# EAGLE schematic edcmain (EAGLE 9.6.2)

## Sheet 1 of 7
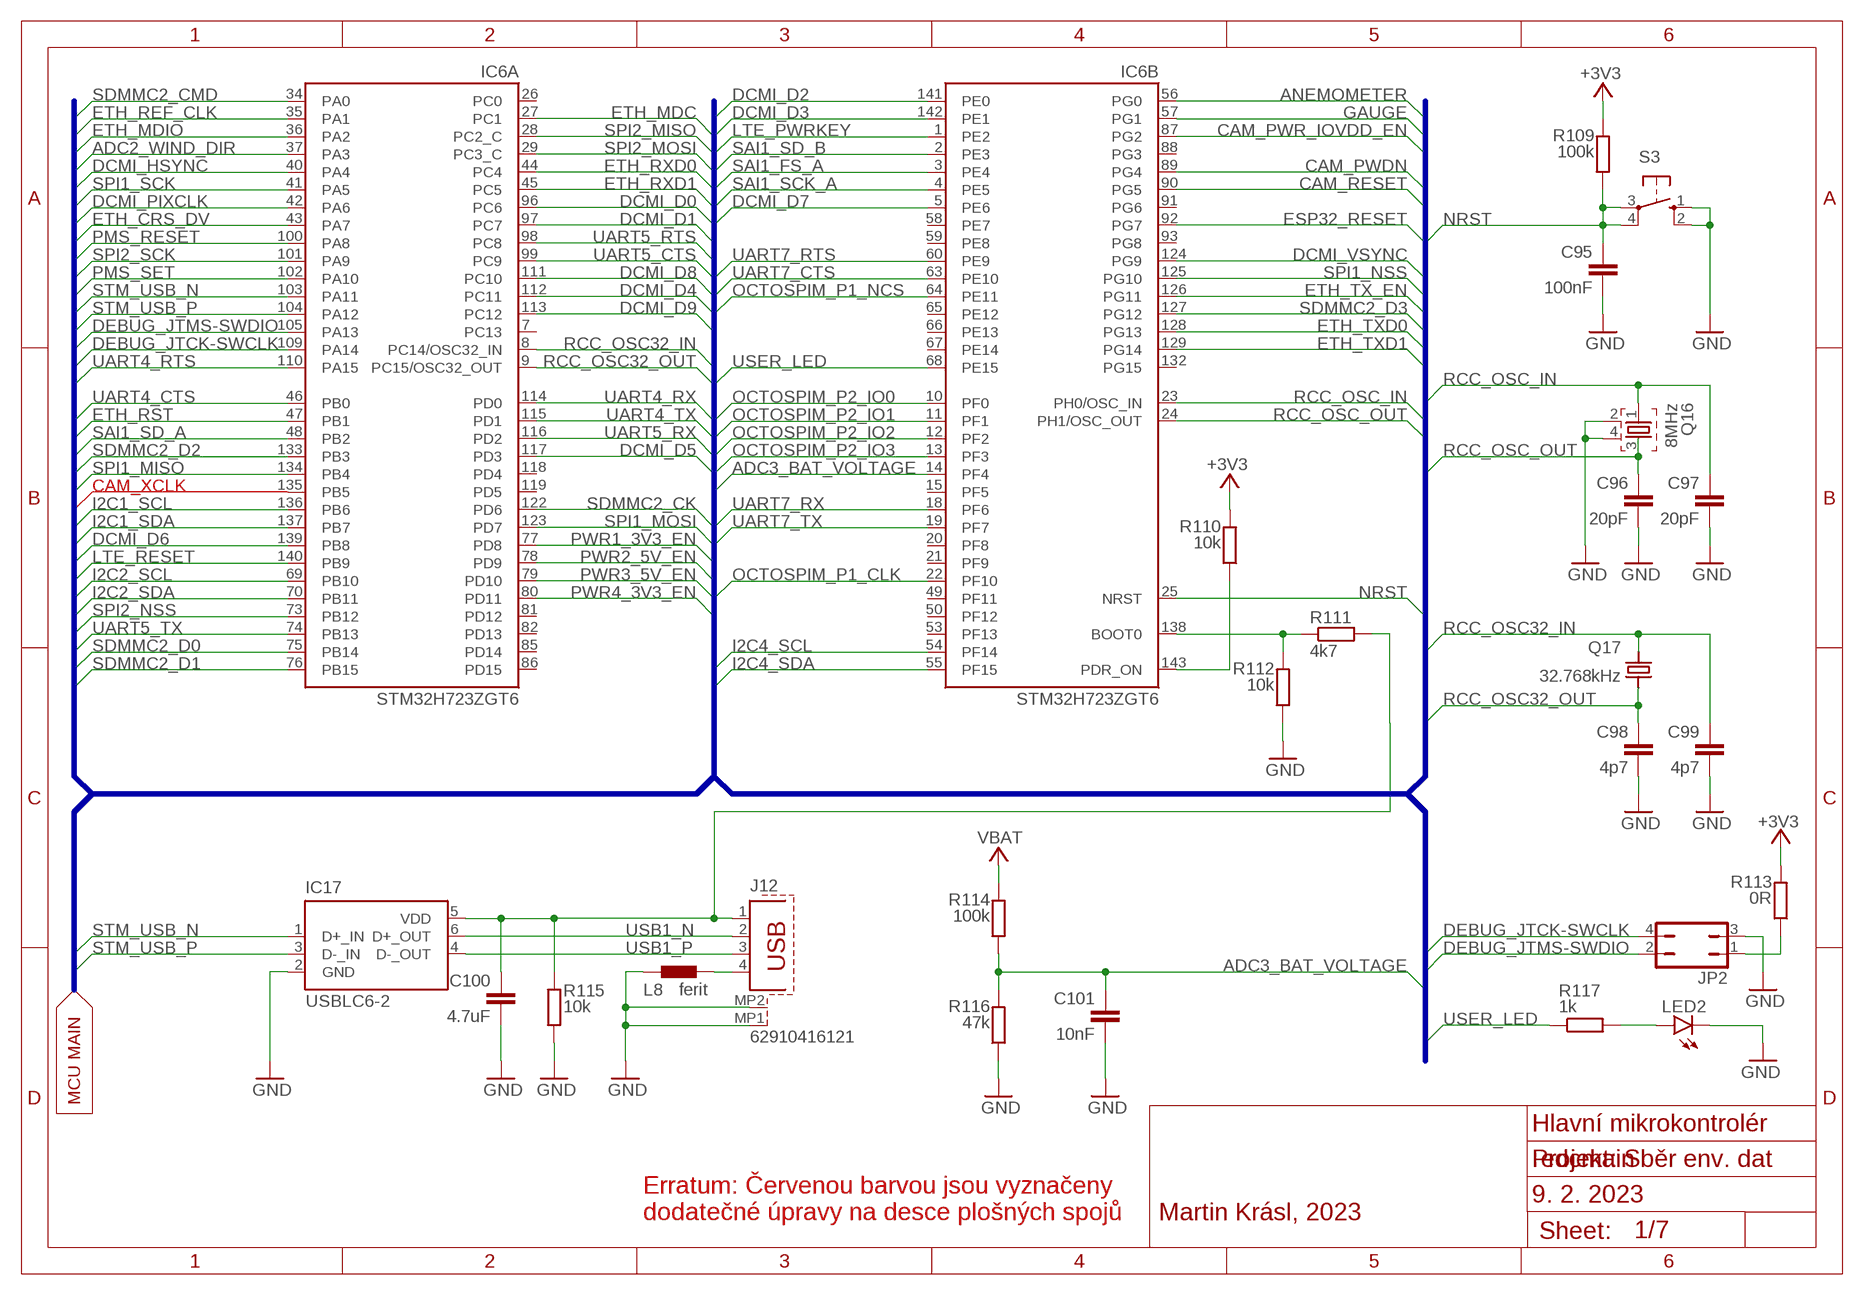
[diagram p0: schematic, sheet 1]

### Parts
C95  100nF  C-EUC0402  [C0402]
C96  20pF  C-EUC0402  [C0402]
C97  20pF  C-EUC0402  [C0402]
C98  4p7  C-EUC0402  [C0402]
C99  4p7  C-EUC0402  [C0402]
C100  4.7uF  C-EUC0402  [C0402]
C101  10nF  C-EUC0402  [C0402]
IC6  STM32H723ZGT6  [QFP50P2200X2200X160-144N]
IC17  USBLC6-2  [SOT23-6]
J12  62910416121  [62910416121]
JP2  JP2Q  [JP2Q]
L8  ferit  BLM15HB121SN1  [0402]
LED2  LEDCHIP-LED0805  [CHIP-LED0805]
Q16  8MHz  CRYSTAL3.2X2.5  [CRYSTAL3.2X2.5]
Q17  32.768kHz  NX3215SA-32.768K-EXS00A-MU0000  [NX3215SA32768KEXS00AMU00003]
R109  100k  R-EU_R0402  [R0402]
R110  10k  R-EU_R0402  [R0402]
R111  4k7  R-EU_R0402  [R0402]
R112  10k  R-EU_R0402  [R0402]
R113  0R  R-EU_R0402  [R0402]
R114  100k  R-EU_R0402  [R0402]
R115  10k  R-EU_R0402  [R0402]
R116  47k  R-EU_R0402  [R0402]
R117  1k  R-EU_R0402  [R0402]
S3  10-XX  [B3F-10XX]

### Nets
+3V3: R109.2 R110.2 R113.2 ; also sheet 2,3,4,5,6,7
ADC2_WIND_DIR: IC6.37(A:PA3) ; also sheet 7
ADC3_BAT_VOLTAGE: C101.1 IC6.14(B:PF4) R114.1 R116.2
ANEMOMETER: IC6.56(B:PG0) ; also sheet 7
CAM_PWDN: IC6.89(B:PG4) ; also sheet 3
CAM_PWR_IOVDD_EN: IC6.87(B:PG2) ; also sheet 3
CAM_RESET: IC6.90(B:PG5) ; also sheet 3
DCMI_D0: IC6.96(A:PC6) ; also sheet 3
DCMI_D1: IC6.97(A:PC7) ; also sheet 3
DCMI_D2: IC6.141(B:PE0) ; also sheet 3
DCMI_D3: IC6.142(B:PE1) ; also sheet 3
DCMI_D4: IC6.112(A:PC11) ; also sheet 3
DCMI_D5: IC6.117(A:PD3) ; also sheet 3
DCMI_D6: IC6.139(A:PB8) ; also sheet 3
DCMI_D7: IC6.5(B:PE6) ; also sheet 3
DCMI_D8: IC6.111(A:PC10) ; also sheet 3
DCMI_D9: IC6.113(A:PC12) ; also sheet 3
DCMI_HSYNC: IC6.40(A:PA4) ; also sheet 3
DCMI_PIXCLK: IC6.42(A:PA6) ; also sheet 3
DCMI_VSYNC: IC6.124(B:PG9) ; also sheet 3
DEBUG_JTCK-SWCLK: IC6.109(A:PA14) JP2.4
DEBUG_JTMS-SWDIO: IC6.105(A:PA13) JP2.2
ESP32_RESET: IC6.92(B:PG7) ; also sheet 5
ETH_CRS_DV: IC6.43(A:PA7) ; also sheet 6
ETH_MDC: IC6.27(A:PC1) ; also sheet 6
ETH_MDIO: IC6.36(A:PA2) ; also sheet 6
ETH_REF_CLK: IC6.35(A:PA1) ; also sheet 6
ETH_RST: IC6.47(A:PB1) ; also sheet 6
ETH_RXD0: IC6.44(A:PC4) ; also sheet 6
ETH_RXD1: IC6.45(A:PC5) ; also sheet 6
ETH_TX_EN: IC6.126(B:PG11) ; also sheet 6
ETH_TXD0: IC6.128(B:PG13) ; also sheet 6
ETH_TXD1: IC6.129(B:PG14) ; also sheet 6
GAUGE: IC6.57(B:PG1) ; also sheet 7
GND: C95.2 C96.2 C97.2 C98.2 C99.2 C100.2 C101.2 IC17.2(GND) J12.MP1 J12.MP2 JP2.3 L8.1 LED2.C Q16.2 Q16.4 R112.1 R115.1 R116.1 S3.1(S) S3.2(S1) ; also sheet 2,3,4,5,6,7
I2C1_SCL: IC6.136(A:PB6) ; also sheet 3
I2C1_SDA: IC6.137(A:PB7) ; also sheet 3
I2C2_SCL: IC6.69(A:PB10) ; also sheet 7
I2C2_SDA: IC6.70(A:PB11) ; also sheet 7
I2C4_SCL: IC6.54(B:PF14) ; also sheet 7
I2C4_SDA: IC6.55(B:PF15) ; also sheet 7
LTE_PWRKEY: IC6.1(B:PE2) ; also sheet 4
LTE_RESET: IC6.140(A:PB9) ; also sheet 4
N$20: C100.1 IC17.5(VDD) J12.1 R111.2 R115.2
N$23: LED2.A R117.2
N$27: IC6.143(B:PDR_ON) R110.1
N$35: IC6.138(B:BOOT0) R111.1 R112.2
N$72: J12.4 L8.2
N$73: JP2.1 R113.1
NRST: C95.1 IC6.25(B:NRST) R109.1 S3.3(P) S3.4(P1)
OCTOSPIM_P1_CLK: IC6.22(B:PF10) ; also sheet 3
OCTOSPIM_P1_NCS: IC6.64(B:PE11) ; also sheet 3
OCTOSPIM_P2_IO0: IC6.10(B:PF0) ; also sheet 3
OCTOSPIM_P2_IO1: IC6.11(B:PF1) ; also sheet 3
OCTOSPIM_P2_IO2: IC6.12(B:PF2) ; also sheet 3
OCTOSPIM_P2_IO3: IC6.13(B:PF3) ; also sheet 3
PMS_RESET: IC6.100(A:PA8) ; also sheet 7
PMS_SET: IC6.102(A:PA10) ; also sheet 7
PWR1_3V3_EN: IC6.77(A:PD8) ; also sheet 7
PWR2_5V_EN: IC6.78(A:PD9) ; also sheet 7
PWR3_5V_EN: IC6.79(A:PD10) ; also sheet 7
PWR4_3V3_EN: IC6.80(A:PD11) ; also sheet 7
RCC_OSC32_IN: C99.1 IC6.8(A:PC14/OSC32_IN) Q17.2
RCC_OSC32_OUT: C98.1 IC6.9(A:PC15/OSC32_OUT) Q17.1
RCC_OSC_IN: C97.1 IC6.23(B:PH0/OSC_IN) Q16.1
RCC_OSC_OUT: C96.1 IC6.24(B:PH1/OSC_OUT) Q16.3
SAI1_FS_A: IC6.3(B:PE4) ; also sheet 4
SAI1_SCK_A: IC6.4(B:PE5) ; also sheet 4
SAI1_SD_A: IC6.48(A:PB2) ; also sheet 4
SAI1_SD_B: IC6.2(B:PE3) ; also sheet 4
SDMMC2_CK: IC6.122(A:PD6) ; also sheet 7
SDMMC2_CMD: IC6.34(A:PA0) ; also sheet 7
SDMMC2_D0: IC6.75(A:PB14) ; also sheet 7
SDMMC2_D1: IC6.76(A:PB15) ; also sheet 7
SDMMC2_D2: IC6.133(A:PB3) ; also sheet 7
SDMMC2_D3: IC6.127(B:PG12) ; also sheet 7
SPI1_MISO: IC6.134(A:PB4) ; also sheet 5
SPI1_MOSI: IC6.123(A:PD7) ; also sheet 5
SPI1_NSS: IC6.125(B:PG10) ; also sheet 5
SPI1_SCK: IC6.41(A:PA5) ; also sheet 5
SPI2_MISO: IC6.28(A:PC2_C) ; also sheet 7
SPI2_MOSI: IC6.29(A:PC3_C) ; also sheet 7
SPI2_NSS: IC6.73(A:PB12) ; also sheet 7
SPI2_SCK: IC6.101(A:PA9) ; also sheet 7
STM_USB_N: IC6.103(A:PA11) IC17.1(D+_IN)
STM_USB_P: IC6.104(A:PA12) IC17.3(D-_IN)
UART4_CTS: IC6.46(A:PB0) ; also sheet 4
UART4_RTS: IC6.110(A:PA15) ; also sheet 4
UART4_RX: IC6.114(A:PD0) ; also sheet 4
UART4_TX: IC6.115(A:PD1) ; also sheet 4
UART5_CTS: IC6.99(A:PC9) ; also sheet 7
UART5_RTS: IC6.98(A:PC8) ; also sheet 7
UART5_RX: IC6.116(A:PD2) ; also sheet 7
UART5_TX: IC6.74(A:PB13) ; also sheet 7
UART7_CTS: IC6.63(B:PE10) ; also sheet 7
UART7_RTS: IC6.60(B:PE9) ; also sheet 7
UART7_RX: IC6.18(B:PF6) ; also sheet 7
UART7_TX: IC6.19(B:PF7) ; also sheet 7
USB1_N [usb]: IC17.6(D+_OUT) J12.2
USB1_P [usb]: IC17.4(D-_OUT) J12.3
USER_LED: IC6.68(B:PE15) R117.1
VBAT: R114.2 ; also sheet 2
Unconnected: IC6.7(A:PC13) IC6.15(B:PF5) IC6.20(B:PF8) IC6.21(B:PF9) IC6.26(A:PC0) IC6.49(B:PF11) IC6.50(B:PF12) IC6.53(B:PF13) IC6.58(B:PE7) IC6.59(B:PE8) IC6.65(B:PE12) IC6.66(B:PE13) IC6.67(B:PE14) IC6.81(A:PD12) IC6.82(A:PD13) IC6.85(A:PD14) IC6.86(A:PD15) IC6.88(B:PG3) IC6.91(B:PG6) IC6.93(B:PG8) IC6.118(A:PD4) IC6.119(A:PD5) IC6.132(B:PG15) IC6.135(A:PB5)

### Buses
ADC2_WIND_DIR,ADC3_BAT_VOLTAGE,ANEMOMETER,CAM_PWDN,CAM_PWR_IOVDD_EN,CAM_RESET,DCMI_D0,DCMI_D1,DCMI_D2,DCMI_D3,DCMI_D4,DCMI_D5,DCMI_D6,DCMI_D7,DCMI_D8,DCMI_D9,DCMI_HSYNC,DCMI_PIXCLK,DCMI_VSYNC,DEBUG_JTCK-SWCLK,DEBUG_JTMS-SWDIO,ESP32_RESET,ETH_CRS_DV,ETH_MDC,ETH_MDIO,ETH_REF_CLK,ETH_RST,ETH_RXD0,ETH_RXD1,ETH_TXD0,ETH_TXD1,ETH_TX_EN,GAUGE,I2C1_SCL,I2C1_SDA,I2C2_SCL,I2C2_SDA,I2C4_SCL,I2C4_SDA,LTE_PWRKEY,LTE_RESET,NRST,OCTOSPIM_P1_CLK,OCTOSPIM_P1_NCS,OCTOSPIM_P2_IO0,OCTOSPIM_P2_IO1,OCTOSPIM_P2_IO2,OCTOSPIM_P2_IO3,PMS_RESET,PMS_SET,PWR1_3V3_EN,PWR2_5V_EN,PWR3_5V_EN,PWR4_3V3_EN,RCC_OSC32_IN,RCC_OSC32_OUT,RCC_OSC_IN,RCC_OSC_OUT,SAI1_FS_A,SAI1_SCK_A,SAI1_SD_A,SAI1_SD_B,SDMMC2_CK,SDMMC2_CMD,SDMMC2_D0,SDMMC2_D1,SDMMC2_D2,SDMMC2_D3,SPI1_MISO,SPI1_MOSI,SPI1_NSS,SPI1_SCK,SPI2_MISO,SPI2_MOSI,SPI2_NSS,SPI2_SCK,STM_USB_N,STM_USB_P,UART4_CTS,UART4_RTS,UART4_RX,UART4_TX,UART5_CTS,UART5_RTS,UART5_RX,UART5_TX,UART7_CTS,UART7_RTS,UART7_RX,UART7_TX,USER_LED

### Notes on the sheet
- CAM_XCLK
- MCU MAIN
- Hlavní mikrokontrolér
- Projekt: Sběr env. dat
- 9. 2. 2023
- Erratum: Červenou barvou jsou vyznačeny
  dodatečné úpravy na desce plošných spojů
- Martin Krásl, 2023

## Sheet 2 of 7
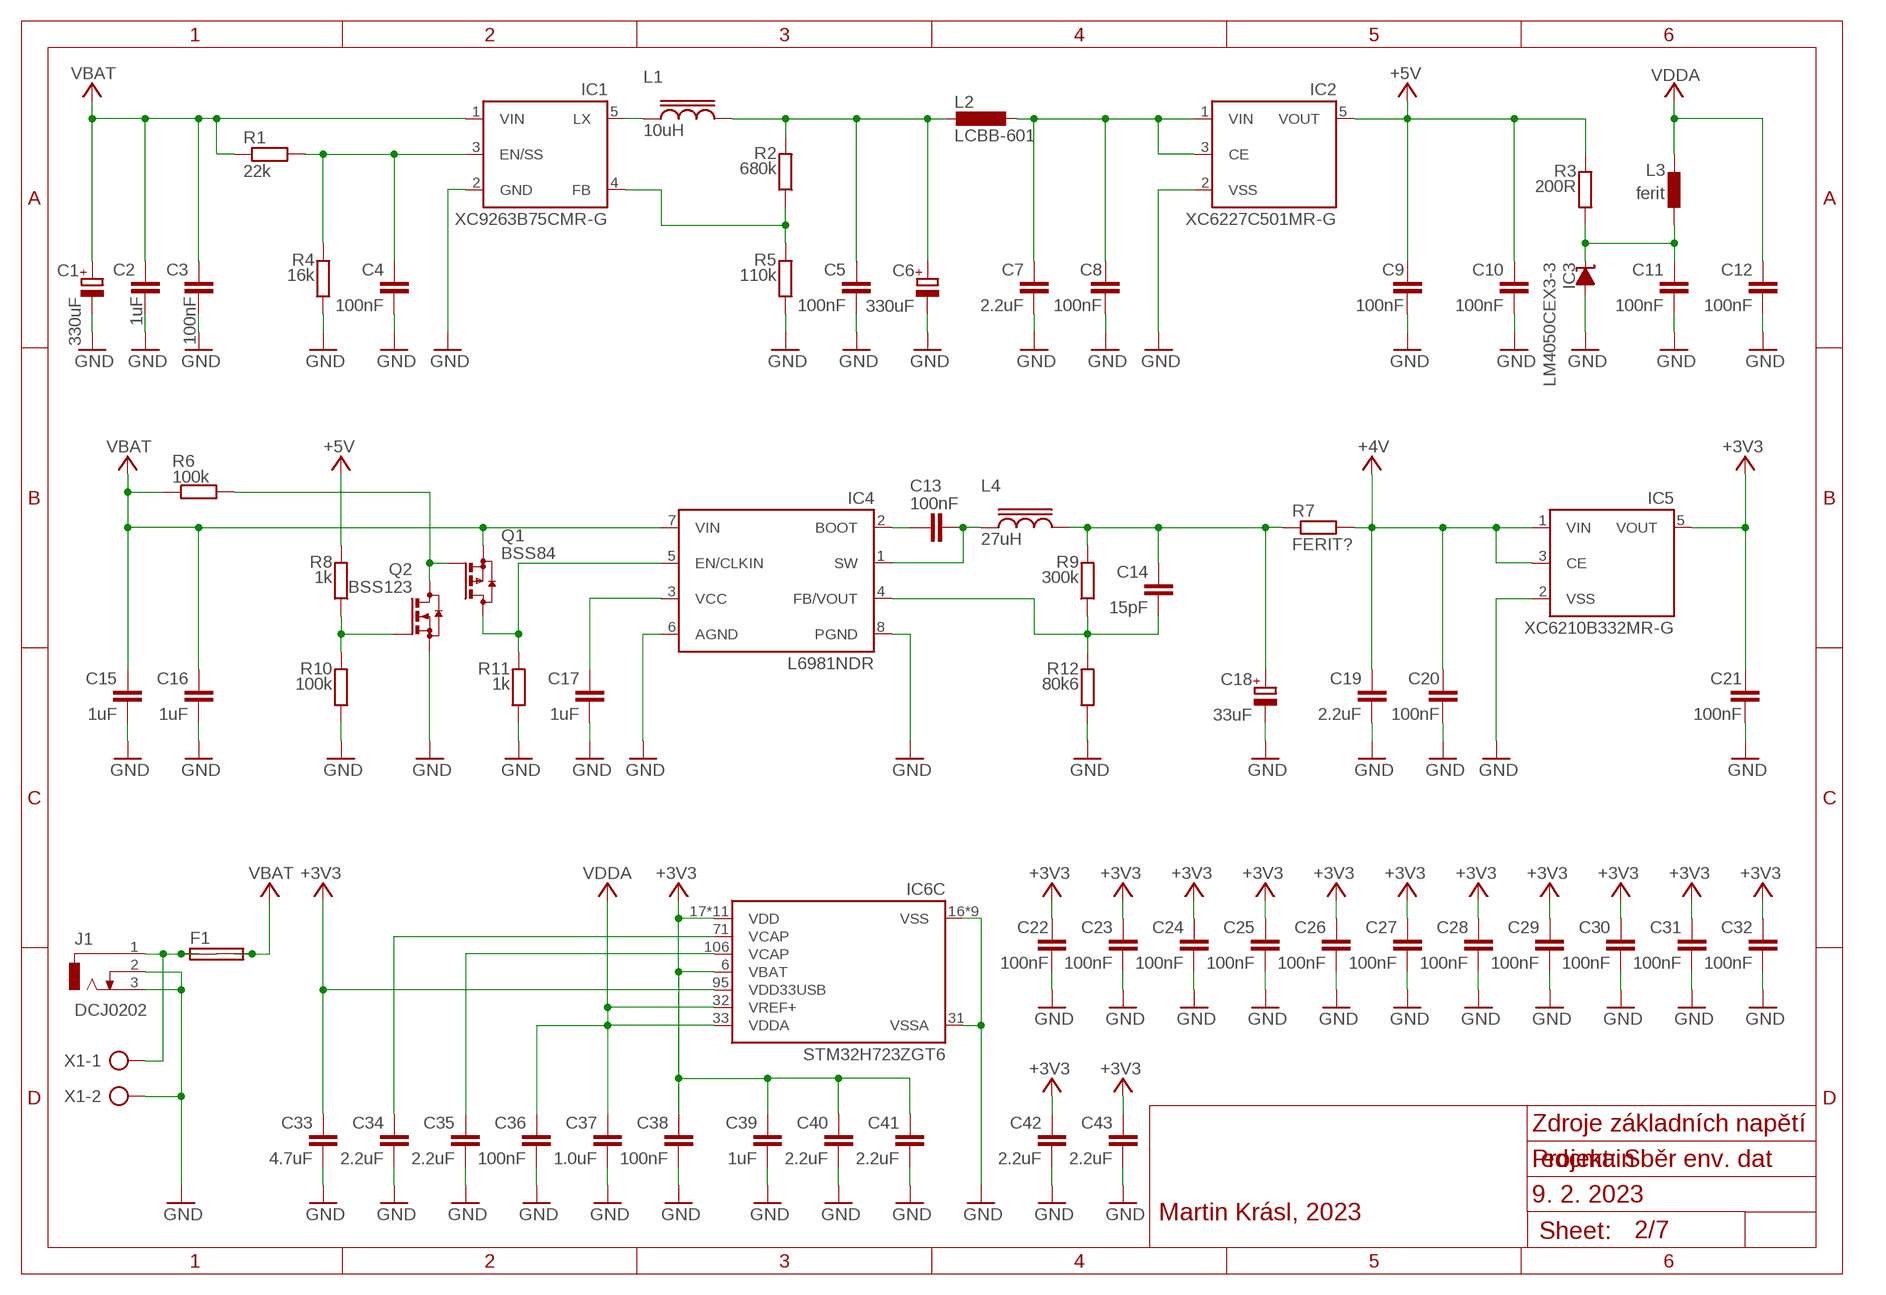
[diagram p1: schematic, sheet 2]

### Parts
C1  330uF  CPOL-EUG  [PANASONIC_G]
C2  1uF  C-EUC0805  [C0805]
C3  100nF  C-EUC0402  [C0402]
C4  100nF  C-EUC0402  [C0402]
C5  100nF  C-EUC0402  [C0402]
C6  330uF  CPOL-EUG  [PANASONIC_G]
C7  2.2uF  C-EUC0805  [C0805]
C8  100nF  C-EUC0402  [C0402]
C9  100nF  C-EUC0402  [C0402]
C10  100nF  C-EUC0402  [C0402]
C11  100nF  C-EUC0402  [C0402]
C12  100nF  C-EUC0402  [C0402]
C13  100nF  C-EUC0402  [C0402]
C14  15pF  C-EUC0402  [C0402]
C15  1uF  C-EUC0805  [C0805]
C16  1uF  C-EUC0805  [C0805]
C17  1uF  C-EUC0402  [C0402]
C18  33uF  CPOL-EUG  [PANASONIC_G]
C19  2.2uF  C-EUC0402  [C0402]
C20  100nF  C-EUC0402  [C0402]
C21  100nF  C-EUC0402  [C0402]
C22  100nF  C-EUC0402  [C0402]
C23  100nF  C-EUC0402  [C0402]
C24  100nF  C-EUC0402  [C0402]
C25  100nF  C-EUC0402  [C0402]
C26  100nF  C-EUC0402  [C0402]
C27  100nF  C-EUC0402  [C0402]
C28  100nF  C-EUC0402  [C0402]
C29  100nF  C-EUC0402  [C0402]
C30  100nF  C-EUC0402  [C0402]
C31  100nF  C-EUC0402  [C0402]
C32  100nF  C-EUC0402  [C0402]
C33  4.7uF  C-EUC0402  [C0402]
C34  2.2uF  C-EUC0805  [C0805]
C35  2.2uF  C-EUC0805  [C0805]
C36  100nF  C-EUC0402  [C0402]
C37  1.0uF  C-EUC0402  [C0402]
C38  100nF  C-EUC0402  [C0402]
C39  1uF  C-EUC0402  [C0402]
C40  2.2uF  C-EUC0402  [C0402]
C41  2.2uF  C-EUC0402  [C0402]
C42  2.2uF  C-EUC0402  [C0402]
C43  2.2uF  C-EUC0805  [C0805]
F1  SHK20L  [SHK20L]
IC1  XC9263B75CMR-G  XC9263B755MR-G  [SOT95P280X130-5N]
IC2  XC6227C501MR-G  XC6210B332MR-G  [SOT95P280X130-5N]
IC3  LM4050CEX3-3  LM4041  [SC70-3]
IC4  L6981NDR  [SOIC127P600X175-8N]
IC5  XC6210B332MR-G  [SOT95P280X130-5N]
IMG1  IMAGEPRINT  [RD_14_24_PRINT]
J1  DCJ0202  [DCJ0202]
L1  10uH  INDUCTORLQH5BP|4D28  [L6]
L2  LCBB-601  L-EU2012(0805)  [L2012C]
L3  ferit  BLM15HB121SN1  [0402]
L4  27uH  INDUCTORLQH5BP|4D28  [L6]
Q1  BSS84  [SOT23]
Q2  BSS123  [SOT23]
R1  22k  R-EU_R0402  [R0402]
R2  680k  R-EU_R0402  [R0402]
R3  200R  R-EU_R0402  [R0402]
R4  16k  R-EU_R0402  [R0402]
R5  110k  R-EU_R0402  [R0402]
R6  100k  R-EU_R0402  [R0402]
R7  FERIT?  R-EU_R2010  [R2010]
R8  1k  R-EU_R0402  [R0402]
R9  300k  R-EU_R0402  [R0402]
R10  100k  R-EU_R0402  [R0402]
R11  1k  R-EU_R0402  [R0402]
R12  80k6  R-EU_R0402  [R0402]
X1  AK500/2  [AK500/2]

### Nets
+3V3: C21.1 C22.1 C23.1 C24.1 C25.1 C26.1 C27.1 C28.1 C29.1 C30.1 C31.1 C32.1 C33.1 C38.1 C39.1 C40.1 C41.1 C42.1 C43.1 IC5.5(VOUT) IC6.6(C:VBAT) IC6.17(C:VDD) IC6.30(C:VDD) IC6.39(C:VDD) IC6.52(C:VDD) IC6.62(C:VDD) IC6.72(C:VDD) IC6.84(C:VDD) IC6.95(C:VDD33USB) IC6.108(C:VDD) IC6.121(C:VDD) IC6.131(C:VDD) IC6.144(C:VDD) ; also sheet 1,3,4,5,6,7
+4V: C19.1 C20.1 IC5.1(VIN) IC5.3(CE) R7.2 ; also sheet 4
+5V: C9.1 C10.1 IC2.5(VOUT) R3.2 R8.2 ; also sheet 7
GND: C1.- C2.2 C3.2 C4.2 C5.2 C6.- C7.2 C8.2 C9.2 C10.2 C11.2 C12.2 C15.2 C16.2 C17.2 C18.- C19.2 C20.2 C21.2 C22.2 C23.2 C24.2 C25.2 C26.2 C27.2 C28.2 C29.2 C30.2 C31.2 C32.2 C33.2 C34.2 C35.2 C36.2 C37.2 C38.2 C39.2 C40.2 C41.2 C42.2 C43.2 IC1.2(GND) IC2.2(VSS) IC3.1(A) IC4.6(AGND) IC4.8(PGND) IC5.2(VSS) IC6.16(C:VSS) IC6.31(C:VSSA) IC6.38(C:VSS) IC6.51(C:VSS) IC6.61(C:VSS) IC6.83(C:VSS) IC6.94(C:VSS) IC6.107(C:VSS) IC6.120(C:VSS) IC6.130(C:VSS) J1.2 J1.3 Q2.2(S) R4.1 R5.1 R10.1 R11.1 R12.1 X1.2 ; also sheet 1,3,4,5,6,7
N$22: F1.1A F1.1B J1.1 X1.1
N$70: C34.1 IC6.71(C:VCAP)
N$71: C35.1 IC6.106(C:VCAP)
N$82: C11.1 IC3.2(C) L3.1 R3.1
N$103: C17.1 IC4.3(VCC)
N$113: C7.1 C8.1 IC2.1(VIN) IC2.3(CE) L2.1
N$114: C5.1 C6.+ L1.P$2 L2.2 R2.2
N$126: IC1.5(LX) L1.P$1
N$127: IC1.4(FB) R2.1 R5.2
N$128: C4.1 IC1.3(EN/SS) R1.2 R4.2
N$131: C14.2 IC4.4(FB/VOUT) R9.1 R12.2
N$133: C13.1 IC4.2(BOOT)
N$135: C13.2 IC4.1(SW) L4.P$1
N$136: C14.1 C18.+ L4.P$2 R7.1 R9.2
N$137: Q1.1(G) Q2.3(D) R6.2
N$138: IC4.5(EN/CLKIN) Q1.3(D) R11.2
N$139: Q2.1(G) R8.1 R10.2
VBAT: C1.+ C2.1 C3.1 C15.1 C16.1 F1.2A F1.2B IC1.1(VIN) IC4.7(VIN) Q1.2(S) R1.1 R6.1 ; also sheet 1
VDDA: C12.1 C36.1 C37.1 IC6.32(C:VREF+) IC6.33(C:VDDA) L3.2

### Notes on the sheet
- Zdroje základních napětí
- Projekt: Sběr env. dat
- 9. 2. 2023
- Martin Krásl, 2023

## Sheet 3 of 7
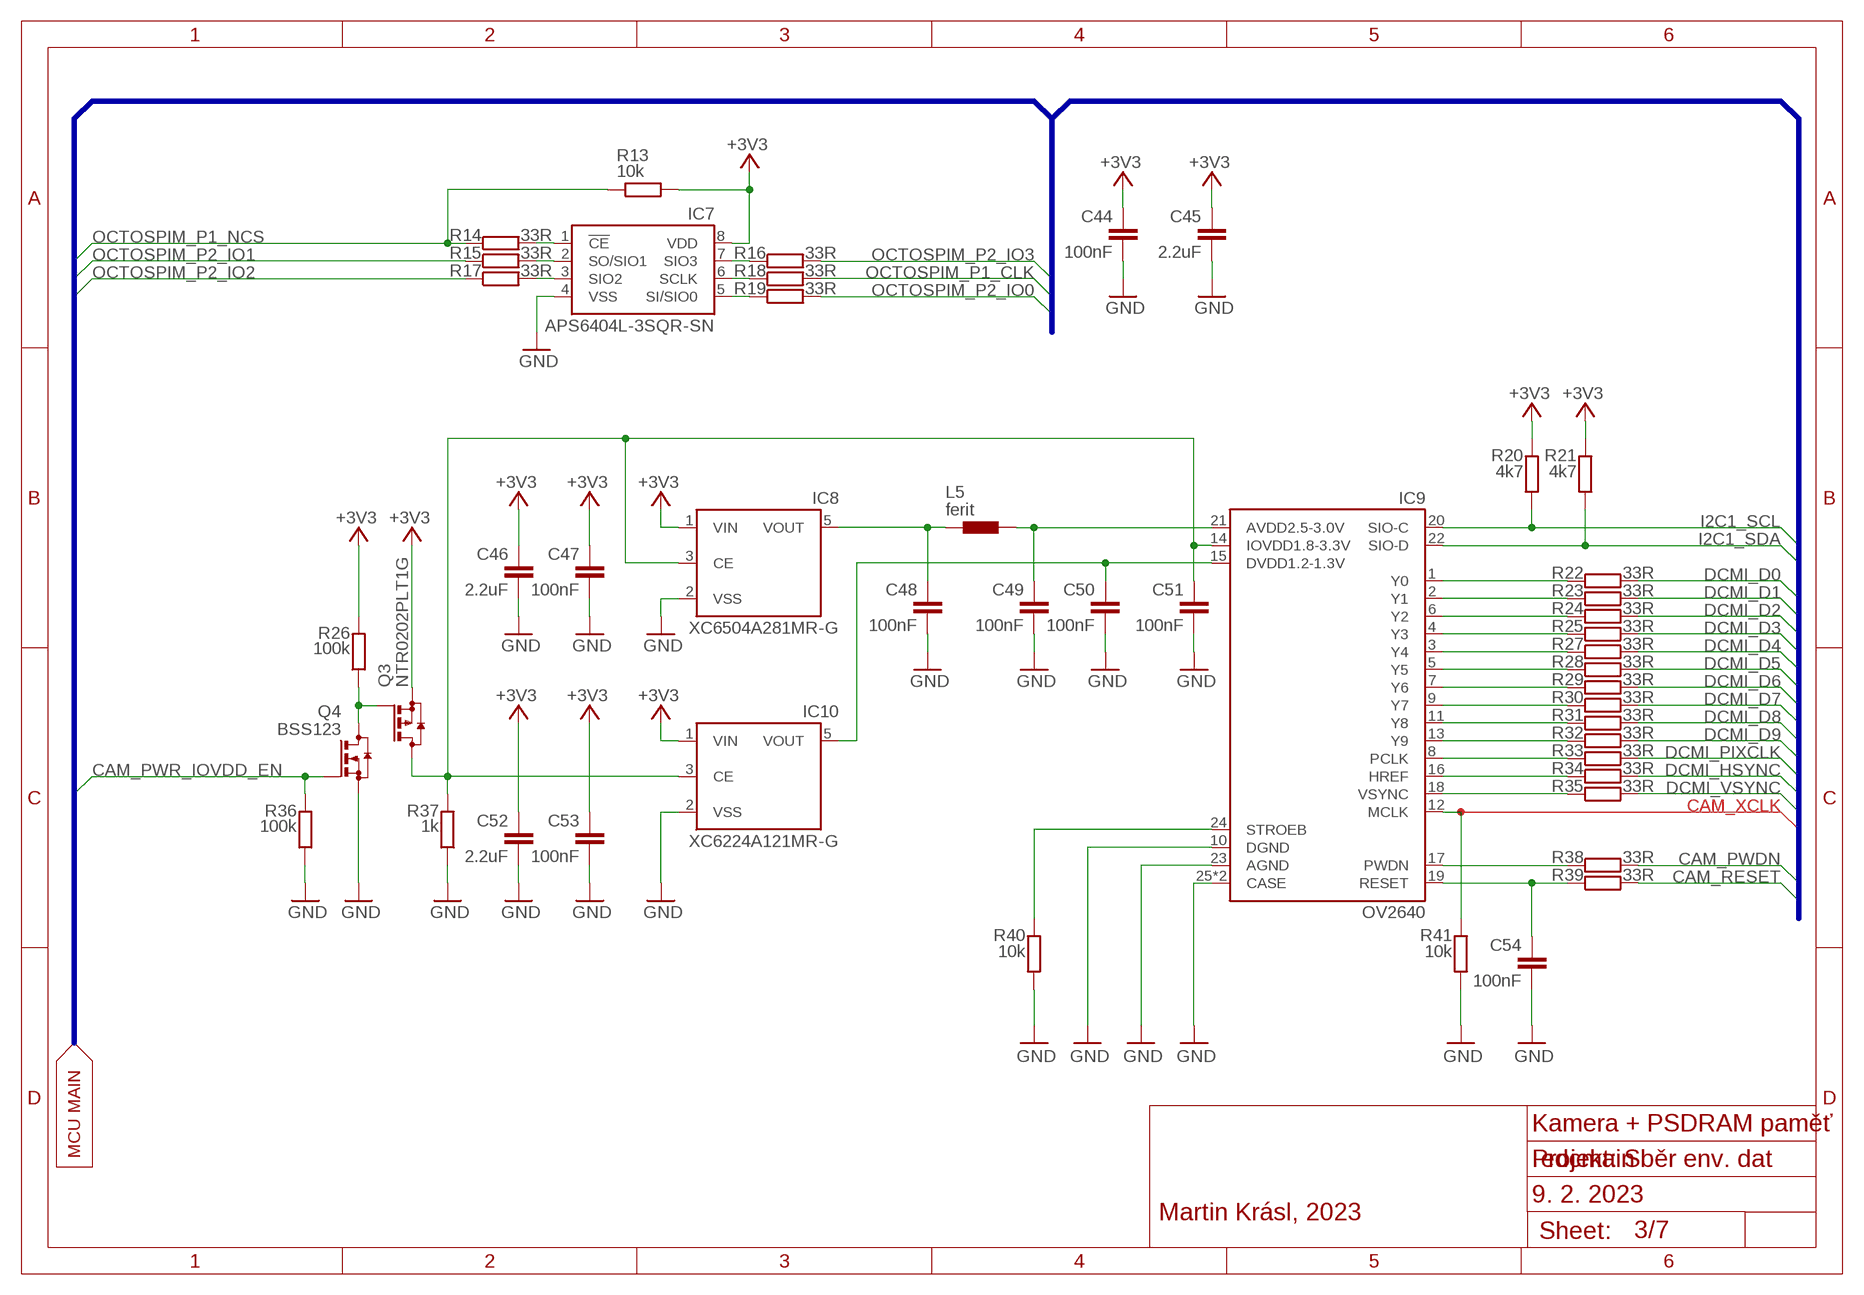
[diagram p2: schematic, sheet 3]

### Parts
C44  100nF  C-EUC0402  [C0402]
C45  2.2uF  C-EUC0402  [C0402]
C46  2.2uF  C-EUC0402  [C0402]
C47  100nF  C-EUC0402  [C0402]
C48  100nF  C-EUC0402  [C0402]
C49  100nF  C-EUC0402  [C0402]
C50  100nF  C-EUC0402  [C0402]
C51  100nF  C-EUC0402  [C0402]
C52  2.2uF  C-EUC0805  [C0805]
C53  100nF  C-EUC0402  [C0402]
C54  100nF  C-EUC0402  [C0402]
IC7  APS6404L-3SQR-SN  [SOP08]
IC8  XC6504A281MR-G  XC6210B332MR-G  [SOT95P280X130-5N]
IC9  OV2640  [XF2M-2415-1A-SWAP]
IC10  XC6224A121MR-G  XC6210B332MR-G  [SOT95P280X130-5N]
L5  ferit  BLM15HB121SN1  [0402]
Q3  NTR0202PLT1G  BSS84  [SOT23]
Q4  BSS123  [SOT23]
R13  10k  R-EU_R0402  [R0402]
R14  33R  R-EU_R0402  [R0402]
R15  33R  R-EU_R0402  [R0402]
R16  33R  R-EU_R0402  [R0402]
R17  33R  R-EU_R0402  [R0402]
R18  33R  R-EU_R0402  [R0402]
R19  33R  R-EU_R0402  [R0402]
R20  4k7  R-EU_R0402  [R0402]
R21  4k7  R-EU_R0402  [R0402]
R22  33R  R-EU_R0402  [R0402]
R23  33R  R-EU_R0402  [R0402]
R24  33R  R-EU_R0402  [R0402]
R25  33R  R-EU_R0402  [R0402]
R26  100k  R-EU_R0402  [R0402]
R27  33R  R-EU_R0402  [R0402]
R28  33R  R-EU_R0402  [R0402]
R29  33R  R-EU_R0402  [R0402]
R30  33R  R-EU_R0402  [R0402]
R31  33R  R-EU_R0402  [R0402]
R32  33R  R-EU_R0402  [R0402]
R33  33R  R-EU_R0402  [R0402]
R34  33R  R-EU_R0402  [R0402]
R35  33R  R-EU_R0402  [R0402]
R36  100k  R-EU_R0402  [R0402]
R37  1k  R-EU_R0402  [R0402]
R38  33R  R-EU_R0402  [R0402]
R39  33R  R-EU_R0402  [R0402]
R40  10k  R-EU_R0402  [R0402]
R41  10k  R-EU_R0402  [R0402]

### Nets
+3V3: C44.1 C45.1 C46.1 C47.1 C52.1 C53.1 IC7.8(VDD) IC8.1(VIN) IC10.1(VIN) Q3.2(S) R13.2 R20.2 R21.2 R26.2 ; also sheet 1,2,4,5,6,7
CAM_PWDN: R38.2 ; also sheet 1
CAM_PWR_IOVDD_EN: Q4.1(G) R36.2 ; also sheet 1
CAM_RESET: R39.2 ; also sheet 1
DCMI_D0: R22.2 ; also sheet 1
DCMI_D1: R23.2 ; also sheet 1
DCMI_D2: R24.2 ; also sheet 1
DCMI_D3: R25.2 ; also sheet 1
DCMI_D4: R27.2 ; also sheet 1
DCMI_D5: R28.2 ; also sheet 1
DCMI_D6: R29.2 ; also sheet 1
DCMI_D7: R30.2 ; also sheet 1
DCMI_D8: R31.2 ; also sheet 1
DCMI_D9: R32.2 ; also sheet 1
DCMI_HSYNC: R34.2 ; also sheet 1
DCMI_PIXCLK: R33.2 ; also sheet 1
DCMI_VSYNC: R35.2 ; also sheet 1
GND: C44.2 C45.2 C46.2 C47.2 C48.2 C49.2 C50.2 C51.2 C52.2 C53.2 C54.2 IC7.4(VSS) IC8.2(VSS) IC9.10(DGND) IC9.23(AGND) IC9.25(CASE) IC9.26(CASE) IC10.2(VSS) Q4.2(S) R36.1 R37.1 R40.1 R41.1 ; also sheet 1,2,4,5,6,7
I2C1_SCL: IC9.20(SIO-C) R20.1 ; also sheet 1
I2C1_SDA: IC9.22(SIO-D) R21.1 ; also sheet 1
N$1: IC9.1(Y0) R22.1
N$2: IC9.2(Y1) R23.1
N$3: IC9.6(Y2) R24.1
N$4: IC9.4(Y3) R25.1
N$5: IC9.3(Y4) R27.1
N$6: IC9.5(Y5) R28.1
N$7: IC9.7(Y6) R29.1
N$8: IC9.9(Y7) R30.1
N$9: IC9.11(Y8) R31.1
N$10: IC9.13(Y9) R32.1
N$11: IC7.1(!CE!) R14.2
N$12: IC7.2(SO/SIO1) R15.2
N$13: IC7.3(SIO2) R17.2
N$14: IC7.7(SIO3) R16.1
N$15: IC7.6(SCLK) R18.1
N$16: IC7.5(SI/SIO0) R19.1
N$17: IC9.18(VSYNC) R35.1
N$18: IC9.16(HREF) R34.1
N$19: IC9.8(PCLK) R33.1
N$29: C48.1 IC8.5(VOUT) L5.1
N$30: C49.1 IC9.21(AVDD2.5-3.0V) L5.2
N$31: C50.1 IC9.15(DVDD1.2-1.3V) IC10.5(VOUT)
N$32: IC9.24(STROEB) R40.2
N$36: IC9.17(PWDN) R38.1
N$37: IC9.12(MCLK) R41.2
N$69: C54.1 IC9.19(RESET) R39.1
N$125: Q3.1(G) Q4.3(D) R26.1
N$142: C51.1 IC8.3(CE) IC9.14(IOVDD1.8-3.3V) IC10.3(CE) Q3.3(D) R37.2
OCTOSPIM_P1_CLK: R18.2 ; also sheet 1
OCTOSPIM_P1_NCS: R13.1 R14.1 ; also sheet 1
OCTOSPIM_P2_IO0: R19.2 ; also sheet 1
OCTOSPIM_P2_IO1: R15.1 ; also sheet 1
OCTOSPIM_P2_IO2: R17.1 ; also sheet 1
OCTOSPIM_P2_IO3: R16.2 ; also sheet 1

### Buses
ADC2_WIND_DIR,ADC3_BAT_VOLTAGE,ANEMOMETER,CAM_PWDN,CAM_PWR_IOVDD_EN,CAM_RESET,DCMI_D0,DCMI_D1,DCMI_D2,DCMI_D3,DCMI_D4,DCMI_D5,DCMI_D6,DCMI_D7,DCMI_D8,DCMI_D9,DCMI_HSYNC,DCMI_PIXCLK,DCMI_VSYNC,DEBUG_JTCK-SWCLK,DEBUG_JTMS-SWDIO,ESP32_RESET,ETH_CRS_DV,ETH_MDC,ETH_MDIO,ETH_REF_CLK,ETH_RST,ETH_RXD0,ETH_RXD1,ETH_TXD0,ETH_TXD1,ETH_TX_EN,GAUGE,I2C1_SCL,I2C1_SDA,I2C2_SCL,I2C2_SDA,I2C4_SCL,I2C4_SDA,LTE_PWRKEY,LTE_RESET,NRST,OCTOSPIM_P1_CLK,OCTOSPIM_P1_NCS,OCTOSPIM_P2_IO0,OCTOSPIM_P2_IO1,OCTOSPIM_P2_IO2,OCTOSPIM_P2_IO3,PMS_RESET,PMS_SET,PWR1_3V3_EN,PWR2_5V_EN,PWR3_5V_EN,PWR4_3V3_EN,RCC_OSC32_IN,RCC_OSC32_OUT,RCC_OSC_IN,RCC_OSC_OUT,SAI1_FS_A,SAI1_SCK_A,SAI1_SD_A,SAI1_SD_B,SDMMC2_CK,SDMMC2_CMD,SDMMC2_D0,SDMMC2_D1,SDMMC2_D2,SDMMC2_D3,SPI1_MISO,SPI1_MOSI,SPI1_NSS,SPI1_SCK,SPI2_MISO,SPI2_MOSI,SPI2_NSS,SPI2_SCK,STM_USB_N,STM_USB_P,UART4_CTS,UART4_RTS,UART4_RX,UART4_TX,UART5_CTS,UART5_RTS,UART5_RX,UART5_TX,UART7_CTS,UART7_RTS,UART7_RX,UART7_TX,USER_LED

### Notes on the sheet
- CAM_XCLK
- MCU MAIN
- Kamera + PSDRAM paměť
- Projekt: Sběr env. dat
- 9. 2. 2023
- Martin Krásl, 2023

## Sheet 4 of 7
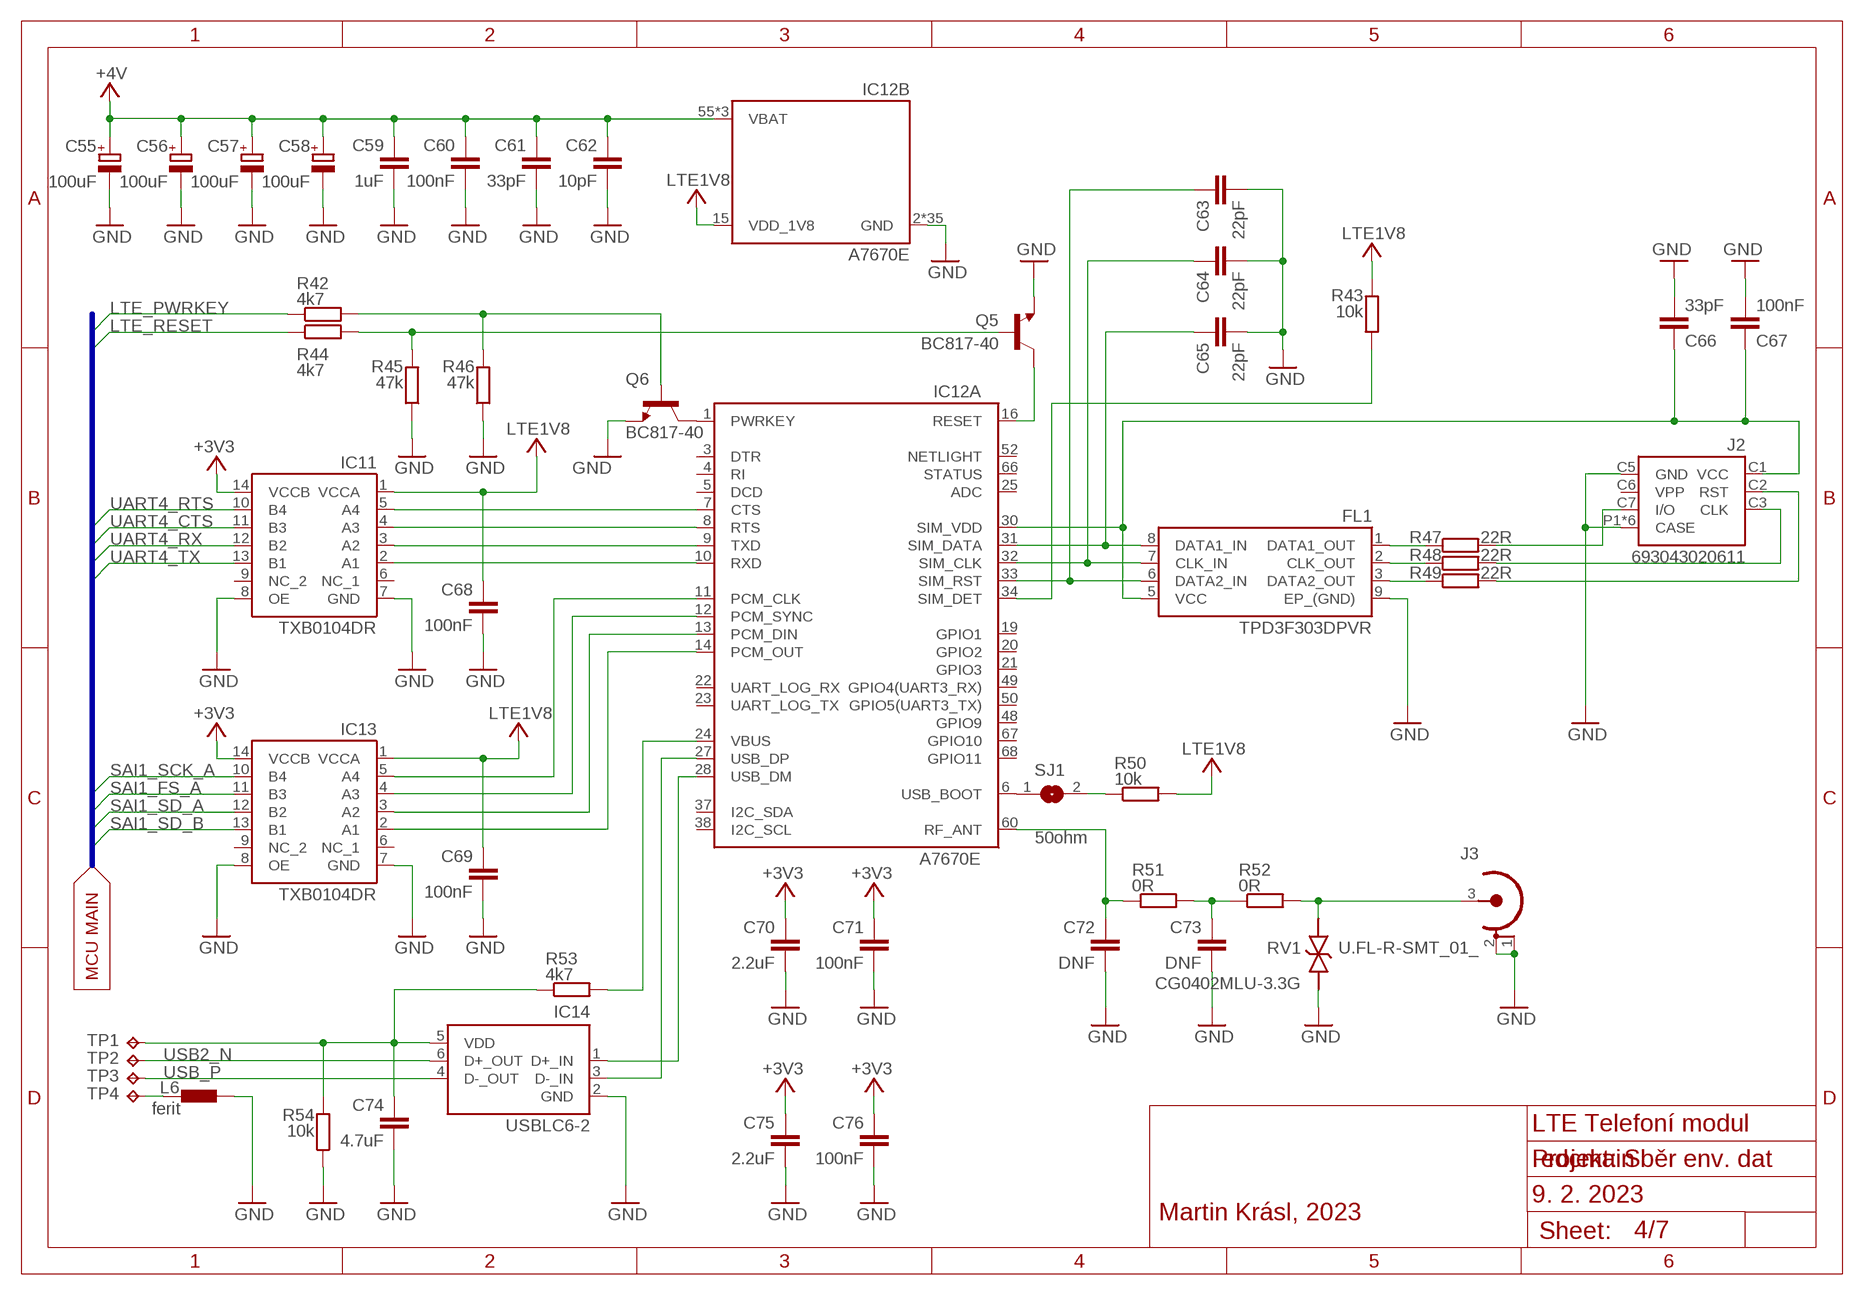
[diagram p3: schematic, sheet 4]

### Parts
C55  100uF  CPOL-EUB/3528-21R  [B/3528-21R]
C56  100uF  CPOL-EUB/3528-21R  [B/3528-21R]
C57  100uF  CPOL-EUB/3528-21R  [B/3528-21R]
C58  100uF  CPOL-EUB/3528-21R  [B/3528-21R]
C59  1uF  C-EUC0805  [C0805]
C60  100nF  C-EUC0402  [C0402]
C61  33pF  C-EUC0402  [C0402]
C62  10pF  C-EUC0402  [C0402]
C63  22pF  C-EUC0402  [C0402]
C64  22pF  C-EUC0402  [C0402]
C65  22pF  C-EUC0402  [C0402]
C66  33pF  C-EUC0402  [C0402]
C67  100nF  C-EUC0402  [C0402]
C68  100nF  C-EUC0402  [C0402]
C69  100nF  C-EUC0402  [C0402]
C70  2.2uF  C-EUC0402  [C0402]
C71  100nF  C-EUC0402  [C0402]
C72  DNF  C-EUC0402  [C0402]
C73  DNF  C-EUC0402  [C0402]
C74  4.7uF  C-EUC0402  [C0402]
C75  2.2uF  C-EUC0402  [C0402]
C76  100nF  C-EUC0402  [C0402]
FL1  TPD3F303DPVR  [SON50P160X210X65-9N]
IC11  TXB0104DR  [SOIC127P600X175-14N]
IC12  A7670E  A7670C-LNSC  [A7670CLNSC]
IC13  TXB0104DR  [SOIC127P600X175-14N]
IC14  USBLC6-2  [SOT23-6]
J2  693043020611  [693043020611]
J3  U.FL-R-SMT_01_  [UFLRSMT01]
L6  ferit  BLM15HB121SN1  [0402]
Q5  BC817-40  BC817-16LT1SMD  [SOT23-BEC]
Q6  BC817-40  BC817-16LT1SMD  [SOT23-BEC]
R42  4k7  R-EU_R0402  [R0402]
R43  10k  R-EU_R0402  [R0402]
R44  4k7  R-EU_R0402  [R0402]
R45  47k  R-EU_R0402  [R0402]
R46  47k  R-EU_R0402  [R0402]
R47  22R  R-EU_R0402  [R0402]
R48  22R  R-EU_R0402  [R0402]
R49  22R  R-EU_R0402  [R0402]
R50  10k  R-EU_R0402  [R0402]
R51  0R  R-EU_R0402  [R0402]
R52  0R  R-EU_R0402  [R0402]
R53  4k7  R-EU_R0402  [R0402]
R54  10k  R-EU_R0402  [R0402]
RV1  CG0402MLU-3.3G  [VARC1005X41N]
SJ1  SJ  [SJ]
TP1  TPB1,27  [B1,27]
TP2  TPB1,27  [B1,27]
TP3  TPB1,27  [B1,27]
TP4  TPB1,27  [B1,27]

### Nets
50OHM_1: C72.1 IC12.60(A:RF_ANT) R51.1
50OHM_2: C73.1 R51.2 R52.1
50OHM_3: J3.3(SIG) R52.2 RV1.1
+3V3: C70.1 C71.1 C75.1 C76.1 IC11.14(VCCB) IC13.14(VCCB) ; also sheet 1,2,3,5,6,7
+4V: C55.+ C56.+ C57.+ C58.+ C59.1 C60.1 C61.1 C62.1 IC12.55(B:VBAT) IC12.56(B:VBAT) IC12.57(B:VBAT) ; also sheet 2
GND: C55.- C56.- C57.- C58.- C59.2 C60.2 C61.2 C62.2 C63.2 C64.2 C65.2 C66.2 C67.2 C68.2 C69.2 C70.2 C71.2 C72.2 C73.2 C74.2 C75.2 C76.2 FL1.9(EP_(GND)) IC11.7(GND) IC11.8(OE) IC12.2(B:GND) IC12.17(B:GND) IC12.18(B:GND) IC12.29(B:GND) IC12.39(B:GND) IC12.45(B:GND) IC12.46(B:GND) IC12.54(B:GND) IC12.58(B:GND) IC12.59(B:GND) IC12.61(B:GND) IC12.62(B:GND) IC12.63(B:GND) IC12.64(B:GND) IC12.65(B:GND) IC12.69(B:GND) IC12.70(B:GND) IC12.71(B:GND) IC12.72(B:GND) IC12.73(B:GND) IC12.74(B:GND) IC12.75(B:GND) IC12.76(B:GND) IC12.77(B:GND) IC12.78(B:GND) IC12.79(B:GND) IC12.80(B:GND) IC12.81(B:GND) IC12.82(B:GND) IC12.83(B:GND) IC12.84(B:GND) IC12.85(B:GND) IC12.86(B:GND) IC12.87(B:GND) IC12.88(B:GND) IC13.7(GND) IC13.8(OE) IC14.2(GND) J2.C5(GND) J2.P1(CASE) J2.P2(CASE) J2.P3(CASE) J2.P4(CASE) J2.P5(CASE) J2.P6(CASE) J3.1(GND) J3.2(GND) L6.1 Q5.E Q6.E R45.1 R46.1 R54.1 RV1.2 ; also sheet 1,2,3,5,6,7
LTE1V8: C68.1 C69.1 IC11.1(VCCA) IC12.15(B:VDD_1V8) IC13.1(VCCA) R43.2 R50.2
LTE_PWRKEY: R42.1 ; also sheet 1
LTE_RESET: R44.1 ; also sheet 1
N$24: IC11.5(A4) IC12.7(A:CTS)
N$25: IC11.4(A3) IC12.8(A:RTS)
N$26: IC11.3(A2) IC12.9(A:TXD)
N$33: IC11.2(A1) IC12.10(A:RXD)
N$34: IC12.11(A:PCM_CLK) IC13.5(A4)
N$38: IC12.12(A:PCM_SYNC) IC13.4(A3)
N$39: IC12.13(A:PCM_DIN) IC13.3(A2)
N$40: IC12.14(A:PCM_OUT) IC13.2(A1)
N$41: C66.1 C67.1 FL1.5(VCC) IC12.30(A:SIM_VDD) J2.C1(VCC)
N$43: J2.C2(RST) R49.2
N$44: J2.C3(CLK) R48.2
N$45: J2.C7(I/O) R47.2
N$47: C63.1 FL1.6(DATA2_IN) IC12.33(A:SIM_RST)
N$48: C64.1 FL1.7(CLK_IN) IC12.32(A:SIM_CLK)
N$49: C65.1 FL1.8(DATA1_IN) IC12.31(A:SIM_DATA)
N$50: IC12.34(A:SIM_DET) R43.1
N$94: C74.1 IC14.5(VDD) R53.1 R54.2 TP1.TP
N$95: L6.2 TP4.TP
N$97: IC12.27(A:USB_DP) IC14.3(D-_IN)
N$98: IC12.28(A:USB_DM) IC14.1(D+_IN)
N$101: IC12.24(A:VBUS) R53.2
N$107: IC12.1(A:PWRKEY) Q6.C
N$108: IC12.6(A:USB_BOOT) SJ1.1
N$109: Q6.B R42.2 R46.2
N$110: IC12.16(A:RESET) Q5.C
N$111: R50.1 SJ1.2
N$112: Q5.B R44.2 R45.2
N$121: FL1.3(DATA2_OUT) R49.1
N$149: FL1.2(CLK_OUT) R48.1
N$152: FL1.1(DATA1_OUT) R47.1
SAI1_FS_A: IC13.11(B3) ; also sheet 1
SAI1_SCK_A: IC13.10(B4) ; also sheet 1
SAI1_SD_A: IC13.12(B2) ; also sheet 1
SAI1_SD_B: IC13.13(B1) ; also sheet 1
UART4_CTS: IC11.11(B3) ; also sheet 1
UART4_RTS: IC11.10(B4) ; also sheet 1
UART4_RX: IC11.12(B2) ; also sheet 1
UART4_TX: IC11.13(B1) ; also sheet 1
USB2_N: IC14.6(D+_OUT) TP2.TP
USB_P: IC14.4(D-_OUT) TP3.TP
Unconnected: IC11.6(NC_1) IC11.9(NC_2) IC12.3(A:DTR) IC12.4(A:RI) IC12.5(A:DCD) IC12.19(A:GPIO1) IC12.20(A:GPIO2) IC12.21(A:GPIO3) IC12.22(A:UART_LOG_RX) IC12.23(A:UART_LOG_TX) IC12.25(A:ADC) IC12.26(C:NC_1) IC12.35(C:NC_2) IC12.36(C:NC_3) IC12.37(A:I2C_SDA) IC12.38(A:I2C_SCL) IC12.40(C:NC_4) IC12.41(C:NC_5) IC12.42(C:NC_6) IC12.43(C:NC_7) IC12.44(C:NC_8) IC12.47(C:NC_9) IC12.48(A:GPIO9) IC12.49(A:GPIO4(UART3_RX)) IC12.50(A:GPIO5(UART3_TX)) IC12.51(C:NC_10) IC12.52(A:NETLIGHT) IC12.53(C:NC_11) IC12.66(A:STATUS) IC12.67(A:GPIO10) IC12.68(A:GPIO11) IC13.6(NC_1) IC13.9(NC_2) J2.C6(VPP)

### Buses
ADC2_WIND_DIR,ADC3_BAT_VOLTAGE,ANEMOMETER,CAM_PWDN,CAM_PWR_IOVDD_EN,CAM_RESET,DCMI_D0,DCMI_D1,DCMI_D2,DCMI_D3,DCMI_D4,DCMI_D5,DCMI_D6,DCMI_D7,DCMI_D8,DCMI_D9,DCMI_HSYNC,DCMI_PIXCLK,DCMI_VSYNC,DEBUG_JTCK-SWCLK,DEBUG_JTMS-SWDIO,ESP32_RESET,ETH_CRS_DV,ETH_MDC,ETH_MDIO,ETH_REF_CLK,ETH_RST,ETH_RXD0,ETH_RXD1,ETH_TXD0,ETH_TXD1,ETH_TX_EN,GAUGE,I2C1_SCL,I2C1_SDA,I2C2_SCL,I2C2_SDA,I2C4_SCL,I2C4_SDA,LTE_PWRKEY,LTE_RESET,NRST,OCTOSPIM_P1_CLK,OCTOSPIM_P1_NCS,OCTOSPIM_P2_IO0,OCTOSPIM_P2_IO1,OCTOSPIM_P2_IO2,OCTOSPIM_P2_IO3,PMS_RESET,PMS_SET,PWR1_3V3_EN,PWR2_5V_EN,PWR3_5V_EN,PWR4_3V3_EN,RCC_OSC32_IN,RCC_OSC32_OUT,RCC_OSC_IN,RCC_OSC_OUT,SAI1_FS_A,SAI1_SCK_A,SAI1_SD_A,SAI1_SD_B,SDMMC2_CK,SDMMC2_CMD,SDMMC2_D0,SDMMC2_D1,SDMMC2_D2,SDMMC2_D3,SPI1_MISO,SPI1_MOSI,SPI1_NSS,SPI1_SCK,SPI2_MISO,SPI2_MOSI,SPI2_NSS,SPI2_SCK,STM_USB_N,STM_USB_P,UART4_CTS,UART4_RTS,UART4_RX,UART4_TX,UART5_CTS,UART5_RTS,UART5_RX,UART5_TX,UART7_CTS,UART7_RTS,UART7_RX,UART7_TX,USER_LED

### Notes on the sheet
- 50ohm
- MCU MAIN
- LTE Telefoní modul
- Projekt: Sběr env. dat
- 9. 2. 2023
- Martin Krásl, 2023

## Sheet 5 of 7
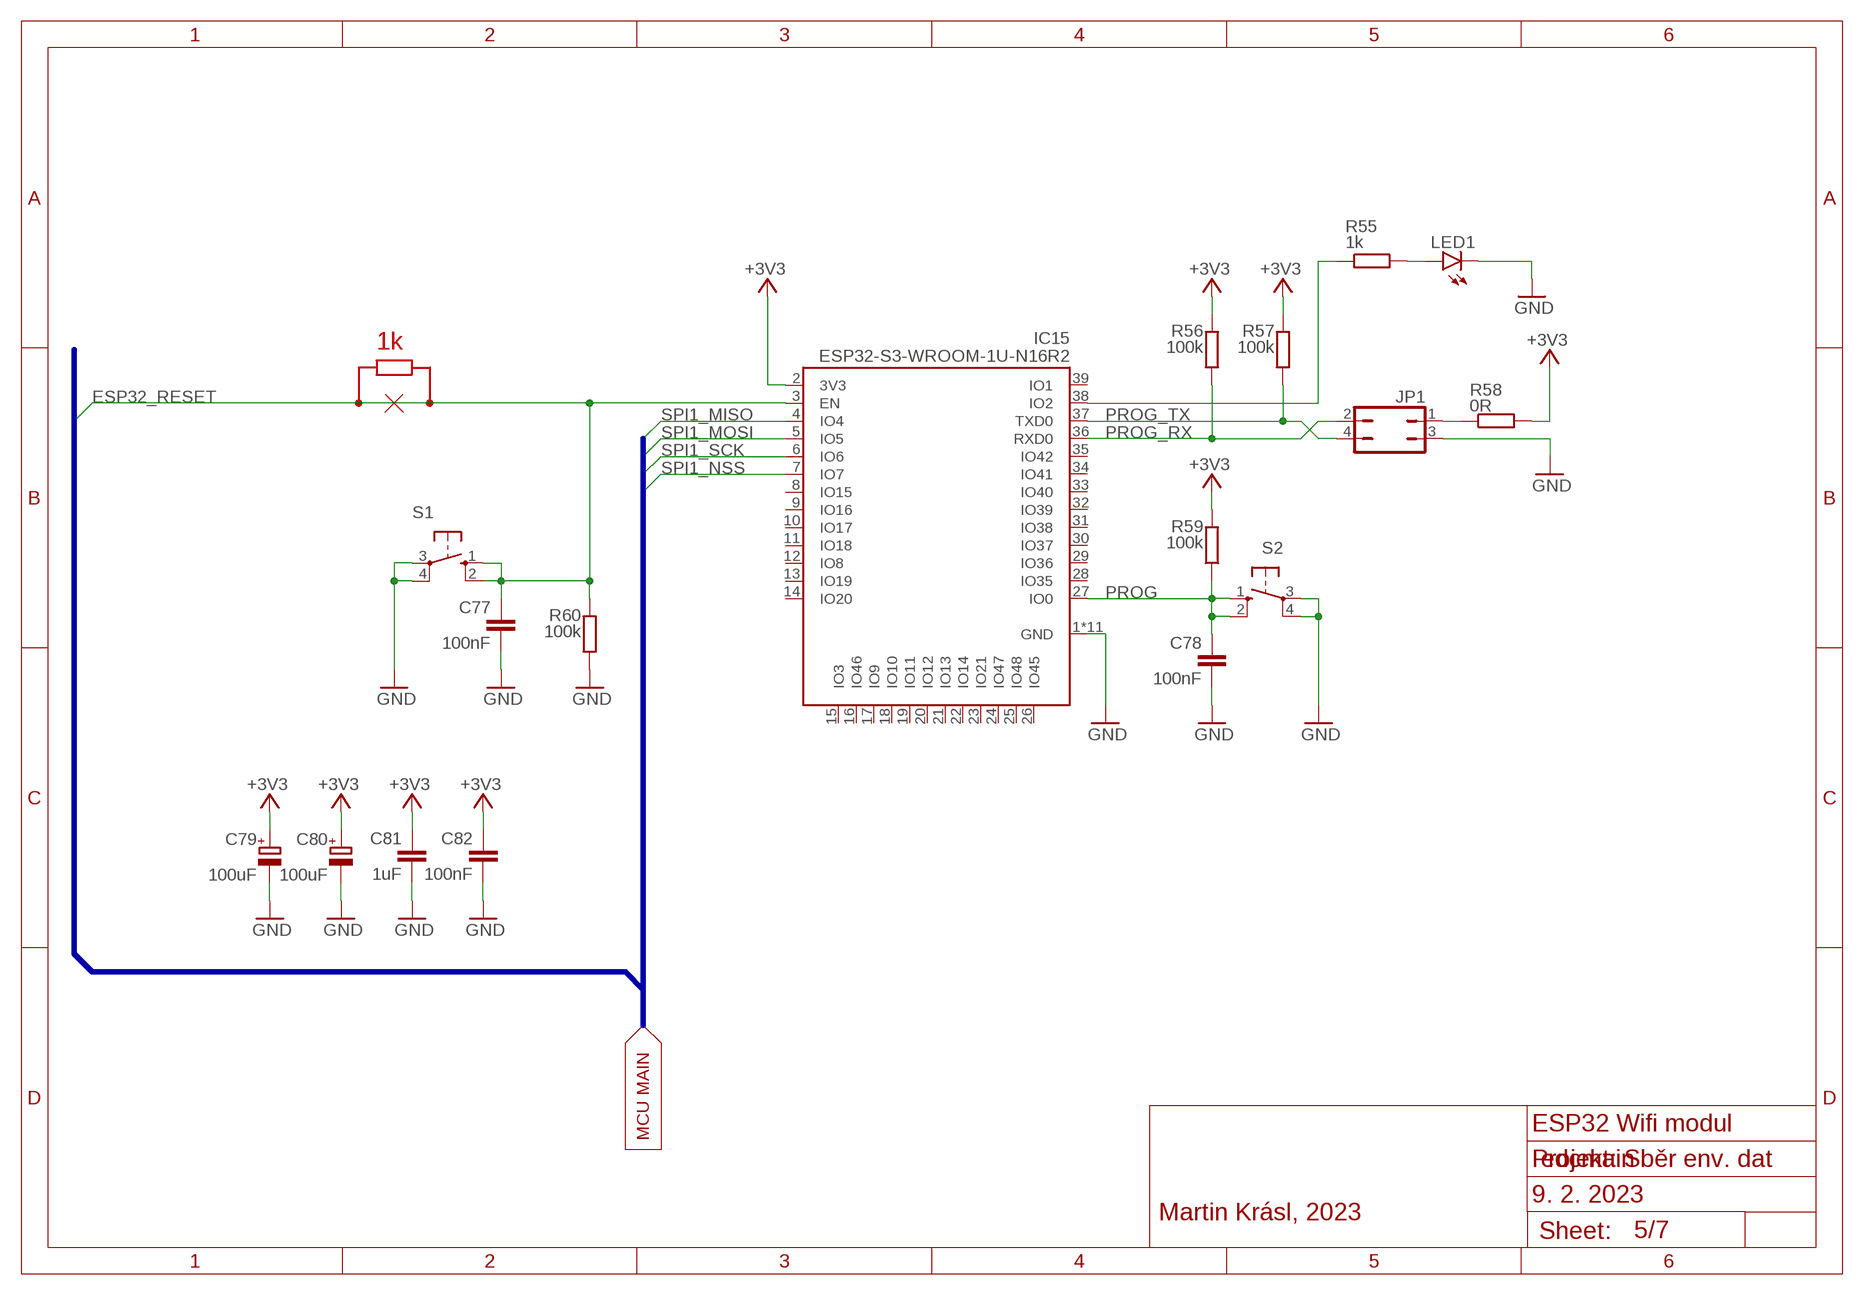
[diagram p4: schematic, sheet 5]

### Parts
C77  100nF  C-EUC0402  [C0402]
C78  100nF  C-EUC0402  [C0402]
C79  100uF  CPOL-EUB/3528-21R  [B/3528-21R]
C80  100uF  CPOL-EUB/3528-21R  [B/3528-21R]
C81  1uF  C-EUC0805  [C0805]
C82  100nF  C-EUC0402  [C0402]
IC15  ESP32-S3-WROOM-1U-N16R2  [ESP32S3WROOM1UN16R2]
JP1  JP2Q  [JP2Q]
LED1  LEDCHIP-LED0805  [CHIP-LED0805]
R55  1k  R-EU_R0402  [R0402]
R56  100k  R-EU_R0402  [R0402]
R57  100k  R-EU_R0402  [R0402]
R58  0R  R-EU_R0402  [R0402]
R59  100k  R-EU_R0402  [R0402]
R60  100k  R-EU_R0402  [R0402]
S1  10-XX  [B3F-10XX]
S2  10-XX  [B3F-10XX]

### Nets
+3V3: C79.+ C80.+ C81.1 C82.1 IC15.2(3V3) R56.2 R57.2 R58.2 R59.2 ; also sheet 1,2,3,4,6,7
ESP32_RESET: C77.1 IC15.3(EN) R60.2 S1.1(S) S1.2(S1) ; also sheet 1
GND: C77.2 C78.2 C79.- C80.- C81.2 C82.2 IC15.1(GND) IC15.40(GND) IC15.41(GND) IC15.42(GND) IC15.43(GND) IC15.44(GND) IC15.45(GND) IC15.46(GND) IC15.47(GND) IC15.48(GND) IC15.49(GND) JP1.3 LED1.C R60.1 S1.3(P) S1.4(P1) S2.3(P) S2.4(P1) ; also sheet 1,2,3,4,6,7
N$117: JP1.1 R58.1
N$122: LED1.A R55.2
N$123: IC15.38(IO2) R55.1
PROG: C78.1 IC15.27(IO0) R59.1 S2.1(S) S2.2(S1)
PROG_RX: IC15.36(RXD0) JP1.2 R56.1
PROG_TX: IC15.37(TXD0) JP1.4 R57.1
SPI1_MISO: IC15.4(IO4) ; also sheet 1
SPI1_MOSI: IC15.5(IO5) ; also sheet 1
SPI1_NSS: IC15.7(IO7) ; also sheet 1
SPI1_SCK: IC15.6(IO6) ; also sheet 1
Unconnected: IC15.8(IO15) IC15.9(IO16) IC15.10(IO17) IC15.11(IO18) IC15.12(IO8) IC15.13(IO19) IC15.14(IO20) IC15.15(IO3) IC15.16(IO46) IC15.17(IO9) IC15.18(IO10) IC15.19(IO11) IC15.20(IO12) IC15.21(IO13) IC15.22(IO14) IC15.23(IO21) IC15.24(IO47) IC15.25(IO48) IC15.26(IO45) IC15.28(IO35) IC15.29(IO36) IC15.30(IO37) IC15.31(IO38) IC15.32(IO39) IC15.33(IO40) IC15.34(IO41) IC15.35(IO42) IC15.39(IO1)

### Buses
ADC2_WIND_DIR,ADC3_BAT_VOLTAGE,ANEMOMETER,CAM_PWDN,CAM_PWR_IOVDD_EN,CAM_RESET,DCMI_D0,DCMI_D1,DCMI_D2,DCMI_D3,DCMI_D4,DCMI_D5,DCMI_D6,DCMI_D7,DCMI_D8,DCMI_D9,DCMI_HSYNC,DCMI_PIXCLK,DCMI_VSYNC,DEBUG_JTCK-SWCLK,DEBUG_JTMS-SWDIO,ESP32_RESET,ETH_CRS_DV,ETH_MDC,ETH_MDIO,ETH_REF_CLK,ETH_RST,ETH_RXD0,ETH_RXD1,ETH_TXD0,ETH_TXD1,ETH_TX_EN,GAUGE,I2C1_SCL,I2C1_SDA,I2C2_SCL,I2C2_SDA,I2C4_SCL,I2C4_SDA,LTE_PWRKEY,LTE_RESET,NRST,OCTOSPIM_P1_CLK,OCTOSPIM_P1_NCS,OCTOSPIM_P2_IO0,OCTOSPIM_P2_IO1,OCTOSPIM_P2_IO2,OCTOSPIM_P2_IO3,PMS_RESET,PMS_SET,PWR1_3V3_EN,PWR2_5V_EN,PWR3_5V_EN,PWR4_3V3_EN,RCC_OSC32_IN,RCC_OSC32_OUT,RCC_OSC_IN,RCC_OSC_OUT,SAI1_FS_A,SAI1_SCK_A,SAI1_SD_A,SAI1_SD_B,SDMMC2_CK,SDMMC2_CMD,SDMMC2_D0,SDMMC2_D1,SDMMC2_D2,SDMMC2_D3,SPI1_MISO,SPI1_MOSI,SPI1_NSS,SPI1_SCK,SPI2_MISO,SPI2_MOSI,SPI2_NSS,SPI2_SCK,STM_USB_N,STM_USB_P,UART4_CTS,UART4_RTS,UART4_RX,UART4_TX,UART5_CTS,UART5_RTS,UART5_RX,UART5_TX,UART7_CTS,UART7_RTS,UART7_RX,UART7_TX,USER_LED

### Notes on the sheet
- 1k
- MCU MAIN
- ESP32 Wifi modul
- Projekt: Sběr env. dat
- 9. 2. 2023
- Martin Krásl, 2023

## Sheet 6 of 7
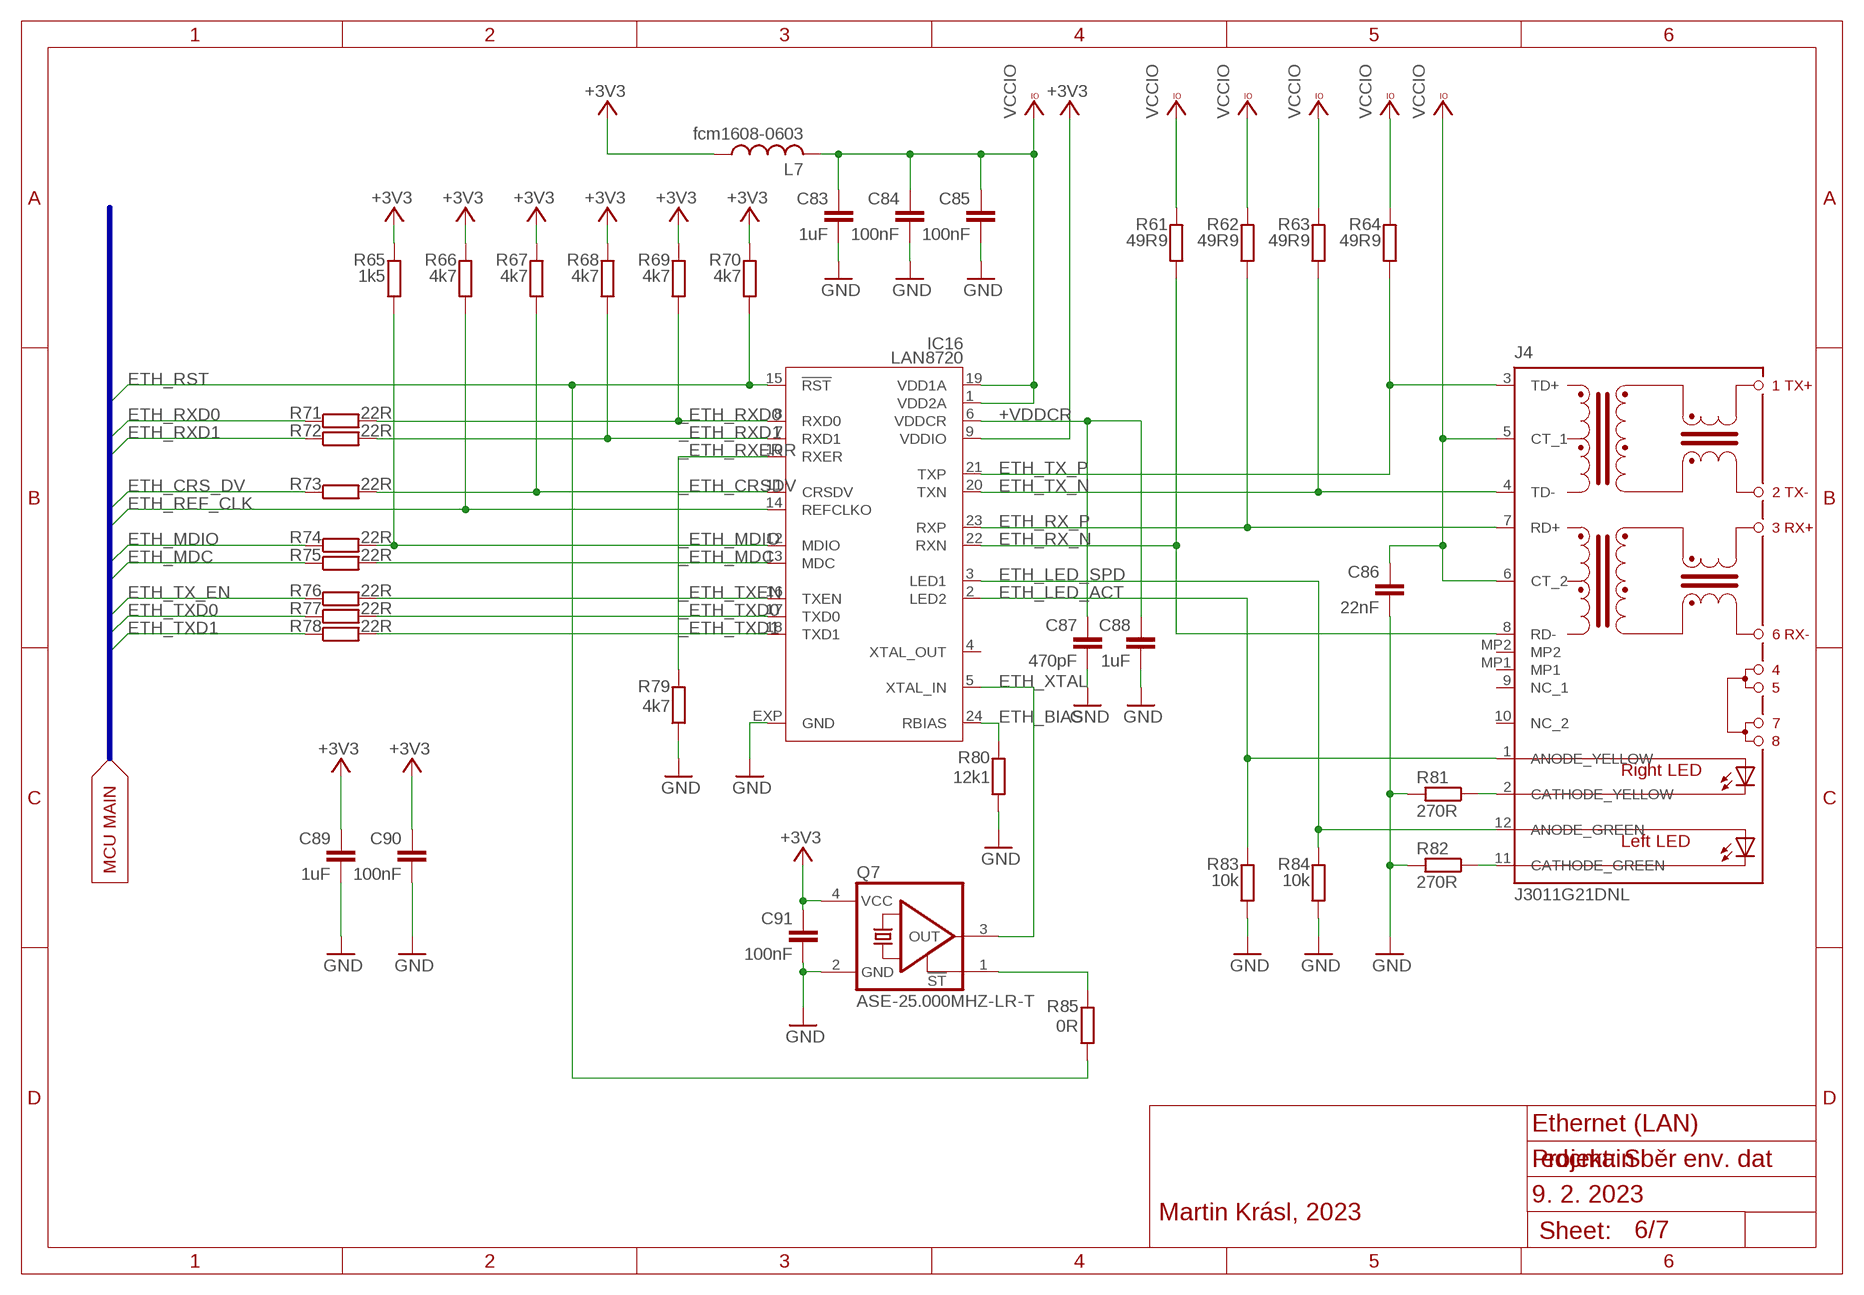
[diagram p5: schematic, sheet 6]

### Parts
C83  1uF  C-EUC0402  [C0402]
C84  100nF  C-EUC0402  [C0402]
C85  100nF  C-EUC0402  [C0402]
C86  22nF  C-EUC0402  [C0402]
C87  470pF  C-EUC0402  [C0402]
C88  1uF  C-EUC0402  [C0402]
C89  1uF  C-EUC0402  [C0402]
C90  100nF  C-EUC0402  [C0402]
C91  100nF  C-EUC0402  [C0402]
IC16  LAN8720  [QFN24]
J4  J3011G21DNL  [J3011G21DNL]
L7  fcm1608-0603  L-USL2012C  [L2012C]
Q7  ASE-25.000MHZ-LR-T  CRYSTAL2.5X2CRYSTAL3.2X2.5  [CRYSTAL3.2X2.5]
R61  49R9  R-EU_R0402  [R0402]
R62  49R9  R-EU_R0402  [R0402]
R63  49R9  R-EU_R0402  [R0402]
R64  49R9  R-EU_R0402  [R0402]
R65  1k5  R-EU_R0402  [R0402]
R66  4k7  R-EU_R0402  [R0402]
R67  4k7  R-EU_R0402  [R0402]
R68  4k7  R-EU_R0402  [R0402]
R69  4k7  R-EU_R0402  [R0402]
R70  4k7  R-EU_R0402  [R0402]
R71  22R  R-EU_R0402  [R0402]
R72  22R  R-EU_R0402  [R0402]
R73  22R  R-EU_R0402  [R0402]
R74  22R  R-EU_R0402  [R0402]
R75  22R  R-EU_R0402  [R0402]
R76  22R  R-EU_R0402  [R0402]
R77  22R  R-EU_R0402  [R0402]
R78  22R  R-EU_R0402  [R0402]
R79  4k7  R-EU_R0402  [R0402]
R80  12k1  R-EU_R0402  [R0402]
R81  270R  R-EU_R0402  [R0402]
R82  270R  R-EU_R0402  [R0402]
R83  10k  R-EU_R0402  [R0402]
R84  10k  R-EU_R0402  [R0402]
R85  0R  R-EU_R0402  [R0402]

### Nets
+3V3: C89.1 C90.1 C91.1 IC16.9(VDDIO) L7.1 Q7.4(VCC) R65.2 R66.2 R67.2 R68.2 R69.2 R70.2 ; also sheet 1,2,3,4,5,7
+VDDCR: C87.1 C88.2 IC16.6(VDDCR)
_ETH_CRSDV: IC16.11(CRSDV) R67.1 R73.2
_ETH_MDC: IC16.13(MDC) R75.2
_ETH_MDIO: IC16.12(MDIO) R65.1 R74.2
_ETH_RXD0: IC16.8(RXD0) R69.1 R71.2
_ETH_RXD1: IC16.7(RXD1) R68.1 R72.2
_ETH_RXERR: IC16.10(RXER) R79.2
_ETH_TXD0: IC16.17(TXD0) R77.2
_ETH_TXD1: IC16.18(TXD1) R78.2
_ETH_TXEN: IC16.16(TXEN) R76.2
ETH_BIAS: IC16.24(RBIAS) R80.1
ETH_CRS_DV: R73.1 ; also sheet 1
ETH_LED_ACT: IC16.2(LED2) J4.1(ANODE_YELLOW) R83.2
ETH_LED_SPD: IC16.3(LED1) J4.12(ANODE_GREEN) R84.2
ETH_MDC: R75.1 ; also sheet 1
ETH_MDIO: R74.1 ; also sheet 1
ETH_REF_CLK: IC16.14(REFCLKO) R66.1 ; also sheet 1
ETH_RST: IC16.15(!RST) R70.1 R85.2 ; also sheet 1
ETH_RX_N [ETH]: IC16.22(RXN) J4.8(RD-) R61.1
ETH_RX_P [ETH]: IC16.23(RXP) J4.7(RD+) R62.1
ETH_RXD0: R71.1 ; also sheet 1
ETH_RXD1: R72.1 ; also sheet 1
ETH_TX_EN: R76.1 ; also sheet 1
ETH_TX_N [ETH]: IC16.20(TXN) J4.4(TD-) R63.1
ETH_TX_P [ETH]: IC16.21(TXP) J4.3(TD+) R64.1
ETH_TXD0: R77.1 ; also sheet 1
ETH_TXD1: R78.1 ; also sheet 1
ETH_XTAL: IC16.5(XTAL_IN) Q7.3(OUT)
GND: C83.2 C84.2 C85.2 C86.2 C87.2 C88.1 C89.2 C90.2 C91.2 IC16.EXP(GND) Q7.2(GND) R79.1 R80.2 R81.2 R82.2 R83.1 R84.1 ; also sheet 1,2,3,4,5,7
N$56: Q7.1(!ST) R85.1
N$61: J4.2(CATHODE_YELLOW) R81.1
N$62: J4.11(CATHODE_GREEN) R82.1
VCCIO: C83.1 C84.1 C85.1 C86.1 IC16.1(VDD2A) IC16.19(VDD1A) J4.5(CT_1) J4.6(CT_2) L7.2 R61.2 R62.2 R63.2 R64.2
Unconnected: IC16.4(XTAL_OUT) J4.9(NC_1) J4.10(NC_2) J4.MP1 J4.MP2

### Buses
ADC2_WIND_DIR,ADC3_BAT_VOLTAGE,ANEMOMETER,CAM_PWDN,CAM_PWR_IOVDD_EN,CAM_RESET,DCMI_D0,DCMI_D1,DCMI_D2,DCMI_D3,DCMI_D4,DCMI_D5,DCMI_D6,DCMI_D7,DCMI_D8,DCMI_D9,DCMI_HSYNC,DCMI_PIXCLK,DCMI_VSYNC,DEBUG_JTCK-SWCLK,DEBUG_JTMS-SWDIO,ESP32_RESET,ETH_CRS_DV,ETH_MDC,ETH_MDIO,ETH_REF_CLK,ETH_RST,ETH_RXD0,ETH_RXD1,ETH_TXD0,ETH_TXD1,ETH_TX_EN,GAUGE,I2C1_SCL,I2C1_SDA,I2C2_SCL,I2C2_SDA,I2C4_SCL,I2C4_SDA,LTE_PWRKEY,LTE_RESET,NRST,OCTOSPIM_P1_CLK,OCTOSPIM_P1_NCS,OCTOSPIM_P2_IO0,OCTOSPIM_P2_IO1,OCTOSPIM_P2_IO2,OCTOSPIM_P2_IO3,PMS_RESET,PMS_SET,PWR1_3V3_EN,PWR2_5V_EN,PWR3_5V_EN,PWR4_3V3_EN,RCC_OSC32_IN,RCC_OSC32_OUT,RCC_OSC_IN,RCC_OSC_OUT,SAI1_FS_A,SAI1_SCK_A,SAI1_SD_A,SAI1_SD_B,SDMMC2_CK,SDMMC2_CMD,SDMMC2_D0,SDMMC2_D1,SDMMC2_D2,SDMMC2_D3,SPI1_MISO,SPI1_MOSI,SPI1_NSS,SPI1_SCK,SPI2_MISO,SPI2_MOSI,SPI2_NSS,SPI2_SCK,STM_USB_N,STM_USB_P,UART4_CTS,UART4_RTS,UART4_RX,UART4_TX,UART5_CTS,UART5_RTS,UART5_RX,UART5_TX,UART7_CTS,UART7_RTS,UART7_RX,UART7_TX,USER_LED

### Notes on the sheet
- MCU MAIN
- Ethernet (LAN)
- Projekt: Sběr env. dat
- 9. 2. 2023
- Martin Krásl, 2023

## Sheet 7 of 7
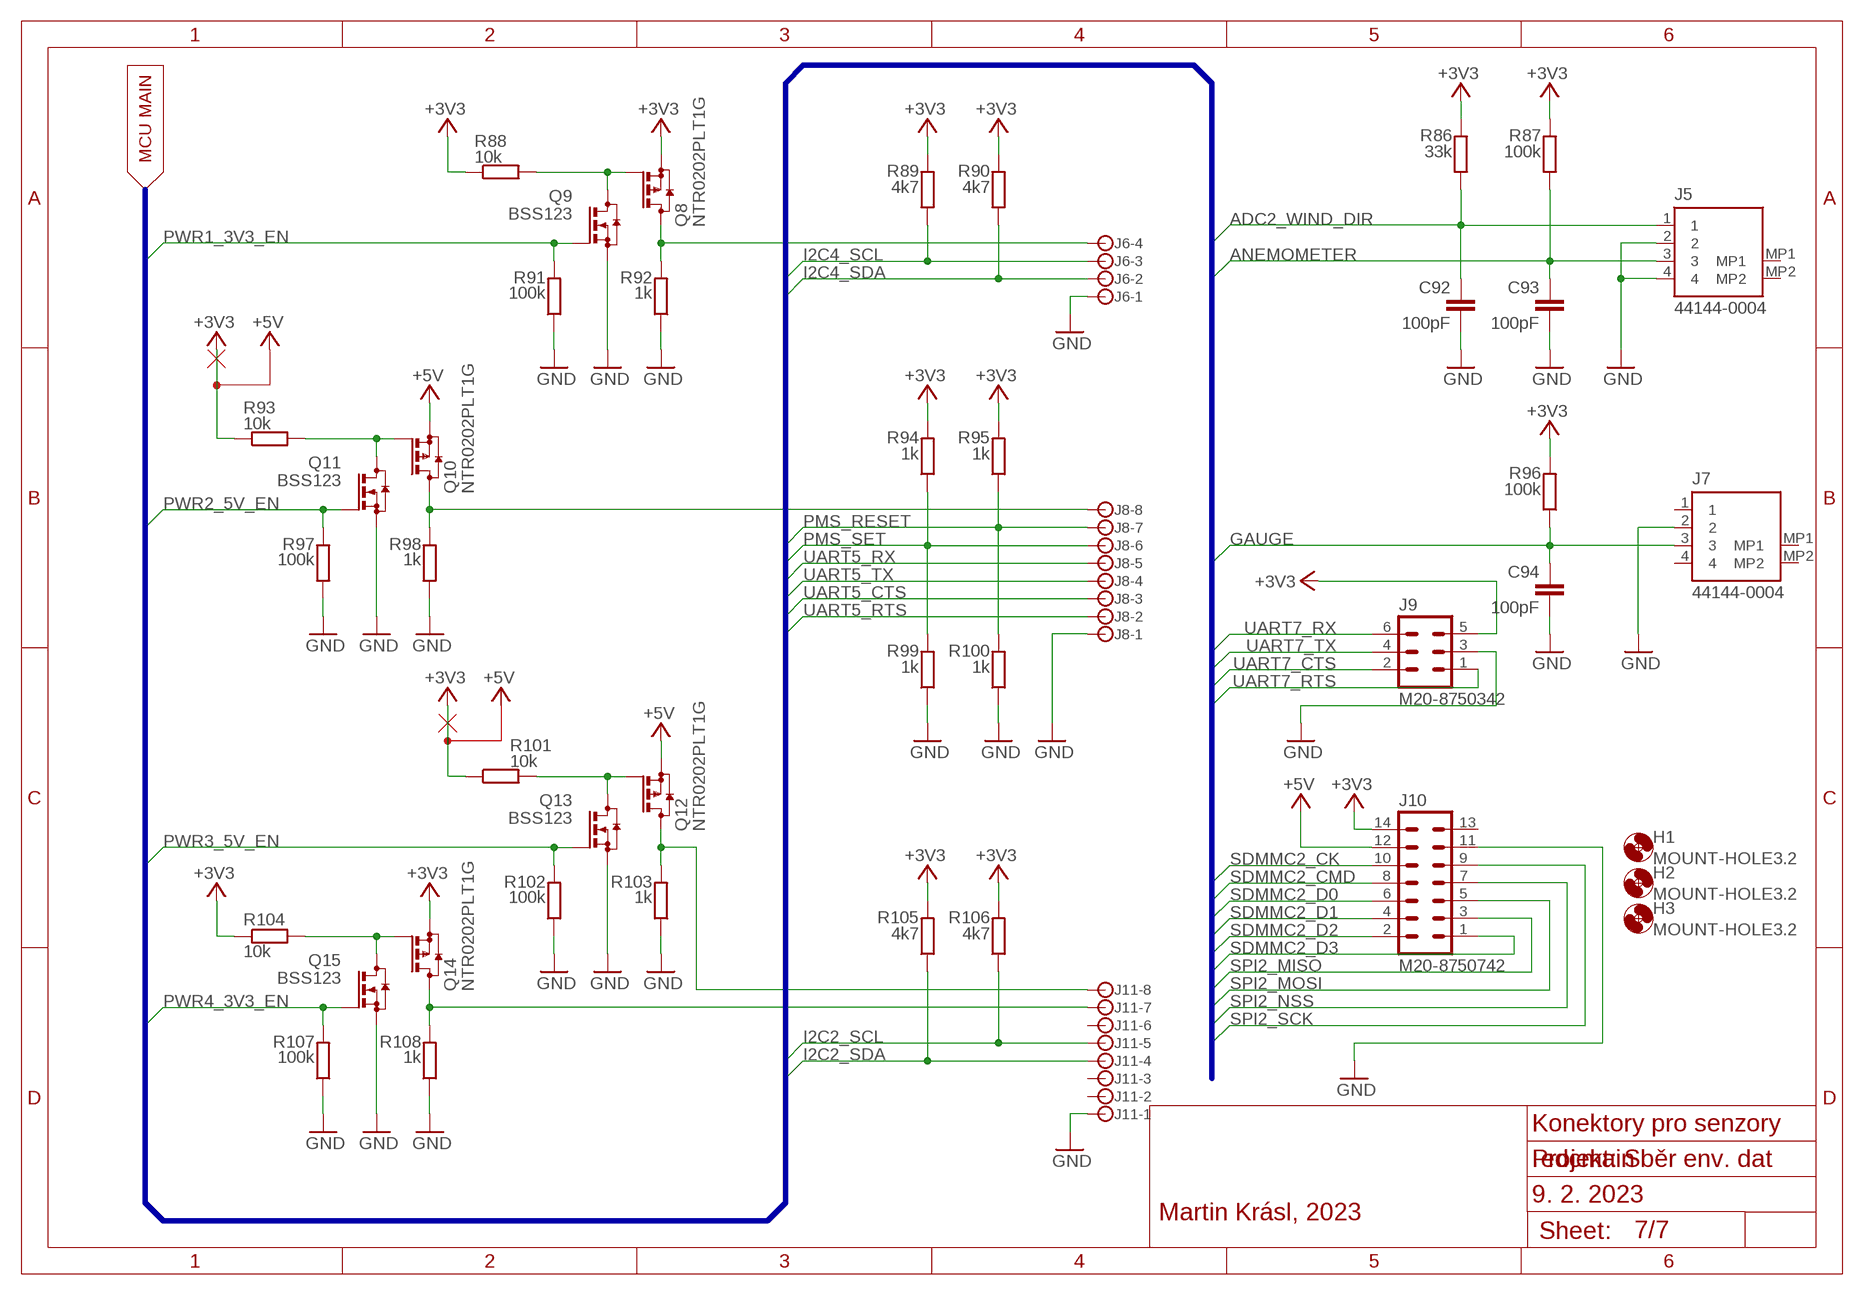
[diagram p6: schematic, sheet 7]

### Parts
C92  100pF  C-EUC0402  [C0402]
C93  100pF  C-EUC0402  [C0402]
C94  100pF  C-EUC0402  [C0402]
H1  MOUNT-HOLE3.2  [3,2]
H2  MOUNT-HOLE3.2  [3,2]
H3  MOUNT-HOLE3.2  [3,2]
J5  44144-0004  [441440004]
J6  JST-XH-4  [B4B-XH-A]
J7  44144-0004  [441440004]
J8  JST-XH-8  [B8B-XH-A]
J9  M20-8750342  [M208750342]
J10  M20-8750742  [M208750742]
J11  JST-XH-8  [B8B-XH-A]
Q8  NTR0202PLT1G  BSS84  [SOT23]
Q9  BSS123  [SOT23]
Q10  NTR0202PLT1G  BSS84  [SOT23]
Q11  BSS123  [SOT23]
Q12  NTR0202PLT1G  BSS84  [SOT23]
Q13  BSS123  [SOT23]
Q14  NTR0202PLT1G  BSS84  [SOT23]
Q15  BSS123  [SOT23]
R86  33k  R-EU_R0402  [R0402]
R87  100k  R-EU_R0402  [R0402]
R88  10k  R-EU_R0402  [R0402]
R89  4k7  R-EU_R0402  [R0402]
R90  4k7  R-EU_R0402  [R0402]
R91  100k  R-EU_R0402  [R0402]
R92  1k  R-EU_R0402  [R0402]
R93  10k  R-EU_R0402  [R0402]
R94  1k  R-EU_R0402  [R0402]
R95  1k  R-EU_R0402  [R0402]
R96  100k  R-EU_R0402  [R0402]
R97  100k  R-EU_R0402  [R0402]
R98  1k  R-EU_R0402  [R0402]
R99  1k  R-EU_R0402  [R0402]
R100  1k  R-EU_R0402  [R0402]
R101  10k  R-EU_R0402  [R0402]
R102  100k  R-EU_R0402  [R0402]
R103  1k  R-EU_R0402  [R0402]
R104  10k  R-EU_R0402  [R0402]
R105  4k7  R-EU_R0402  [R0402]
R106  4k7  R-EU_R0402  [R0402]
R107  100k  R-EU_R0402  [R0402]
R108  1k  R-EU_R0402  [R0402]

### Nets
+3V3: J9.5 J10.14 Q8.2(S) Q14.2(S) R86.2 R87.2 R88.1 R89.2 R90.2 R93.1 R94.2 R95.2 R96.2 R101.1 R104.1 R105.2 R106.2 ; also sheet 1,2,3,4,5,6
+5V: J10.12 Q10.2(S) Q12.2(S) ; also sheet 2
ADC2_WIND_DIR: C92.1 J5.1 R86.1 ; also sheet 1
ANEMOMETER: C93.1 J5.3 R87.1 ; also sheet 1
GAUGE: C94.1 J7.3 R96.1 ; also sheet 1
GND: C92.2 C93.2 C94.2 J5.2 J5.4 J6.1 J7.2 J8.1 J9.3 J10.11 J11.1 Q9.2(S) Q11.2(S) Q13.2(S) Q15.2(S) R91.1 R92.1 R97.1 R98.1 R99.1 R100.1 R102.1 R103.1 R107.1 R108.1 ; also sheet 1,2,3,4,5,6
I2C2_SCL: J11.5 R106.1 ; also sheet 1
I2C2_SDA: J11.4 R105.1 ; also sheet 1
I2C4_SCL: J6.3 R89.1 ; also sheet 1
I2C4_SDA: J6.2 R90.1 ; also sheet 1
N$42: J11.7 Q14.3(D) R108.2
N$46: J11.8 Q12.3(D) R103.2
N$84: Q12.1(G) Q13.3(D) R101.2
N$140: Q10.1(G) Q11.3(D) R93.2
N$144: J8.8 Q10.3(D) R98.2
N$145: Q8.1(G) Q9.3(D) R88.2
N$146: J6.4 Q8.3(D) R92.2
N$150: Q14.1(G) Q15.3(D) R104.2
PMS_RESET: J8.7 R95.1 R100.2 ; also sheet 1
PMS_SET: J8.6 R94.1 R99.2 ; also sheet 1
PWR1_3V3_EN: Q9.1(G) R91.2 ; also sheet 1
PWR2_5V_EN: Q11.1(G) R97.2 ; also sheet 1
PWR3_5V_EN: Q13.1(G) R102.2 ; also sheet 1
PWR4_3V3_EN: Q15.1(G) R107.2 ; also sheet 1
SDMMC2_CK: J10.10 ; also sheet 1
SDMMC2_CMD: J10.8 ; also sheet 1
SDMMC2_D0: J10.6 ; also sheet 1
SDMMC2_D1: J10.4 ; also sheet 1
SDMMC2_D2: J10.2 ; also sheet 1
SDMMC2_D3: J10.1 ; also sheet 1
SPI2_MISO: J10.3 ; also sheet 1
SPI2_MOSI: J10.5 ; also sheet 1
SPI2_NSS: J10.7 ; also sheet 1
SPI2_SCK: J10.9 ; also sheet 1
UART5_CTS: J8.3 ; also sheet 1
UART5_RTS: J8.2 ; also sheet 1
UART5_RX: J8.5 ; also sheet 1
UART5_TX: J8.4 ; also sheet 1
UART7_CTS: J9.2 ; also sheet 1
UART7_RTS: J9.1 ; also sheet 1
UART7_RX: J9.6 ; also sheet 1
UART7_TX: J9.4 ; also sheet 1
Unconnected: J5.MP1 J5.MP2 J7.1 J7.4 J7.MP1 J7.MP2 J10.13 J11.2 J11.3 J11.6

### Buses
ADC2_WIND_DIR,ADC3_BAT_VOLTAGE,ANEMOMETER,CAM_PWDN,CAM_PWR_IOVDD_EN,CAM_RESET,DCMI_D0,DCMI_D1,DCMI_D2,DCMI_D3,DCMI_D4,DCMI_D5,DCMI_D6,DCMI_D7,DCMI_D8,DCMI_D9,DCMI_HSYNC,DCMI_PIXCLK,DCMI_VSYNC,DEBUG_JTCK-SWCLK,DEBUG_JTMS-SWDIO,ESP32_RESET,ETH_CRS_DV,ETH_MDC,ETH_MDIO,ETH_REF_CLK,ETH_RST,ETH_RXD0,ETH_RXD1,ETH_TXD0,ETH_TXD1,ETH_TX_EN,GAUGE,I2C1_SCL,I2C1_SDA,I2C2_SCL,I2C2_SDA,I2C4_SCL,I2C4_SDA,LTE_PWRKEY,LTE_RESET,NRST,OCTOSPIM_P1_CLK,OCTOSPIM_P1_NCS,OCTOSPIM_P2_IO0,OCTOSPIM_P2_IO1,OCTOSPIM_P2_IO2,OCTOSPIM_P2_IO3,PMS_RESET,PMS_SET,PWR1_3V3_EN,PWR2_5V_EN,PWR3_5V_EN,PWR4_3V3_EN,RCC_OSC32_IN,RCC_OSC32_OUT,RCC_OSC_IN,RCC_OSC_OUT,SAI1_FS_A,SAI1_SCK_A,SAI1_SD_A,SAI1_SD_B,SDMMC2_CK,SDMMC2_CMD,SDMMC2_D0,SDMMC2_D1,SDMMC2_D2,SDMMC2_D3,SPI1_MISO,SPI1_MOSI,SPI1_NSS,SPI1_SCK,SPI2_MISO,SPI2_MOSI,SPI2_NSS,SPI2_SCK,STM_USB_N,STM_USB_P,UART4_CTS,UART4_RTS,UART4_RX,UART4_TX,UART5_CTS,UART5_RTS,UART5_RX,UART5_TX,UART7_CTS,UART7_RTS,UART7_RX,UART7_TX,USER_LED

### Notes on the sheet
- MCU MAIN
- Konektory pro senzory
- Projekt: Sběr env. dat
- 9. 2. 2023
- Martin Krásl, 2023

## Library data of the parts
C1 C6 C18 C55-C58 C79 C80 = rcl:CPOL-EU: POLARIZED CAPACITOR, European symbol; SPICEPREFIX: C
C2-C5 C7-C17 C19-C54 C59-C78 C81-C101 = rcl:C-EU: CAPACITOR, European symbol; SPICEPREFIX: C
F1 = fuse:SHK20L: FUSE HOLDER 5 x 20 mm, SH contact, SHH1 Schukat, E1073 Buerklin; OC_FARNELL: unknown; OC_NEWARK: unknown
FL1 = TPD3F303DPVR:TPD3F303DPVR: Texas Instruments, EMI Filter IC 308MHz USON SMD, Flat Contact Termination, 2.2 x 1.7 x 0.6mm Source: Datasheet <http://www.ti.com/lit/gpn/tpd3f303>; ARROW_PART_NUMBER: TPD3F303DPVR; ARROW_PRICE-STOCK: https://www.arrow.com/en/products/tpd3f303dpvr/texas-instruments?region=nac; DESCRIPTION: Texas Instruments, EMI Filter IC 308MHz USON SMD, Flat Contact Termination, 2.2 x 1.7 x 0.6mm; HEIGHT: 0.65mm; MANUFACTURER_NAME: Texas Instruments; MANUFACTURER_PART_NUMBER: TPD3F303DPVR; MOUSER_PART_NUMBER: 595-TPD3F303DPVR; MOUSER_PRICE-STOCK: https://www.mouser.co.uk/ProductDetail/Texas-Instruments/TPD3F303DPVR?qs=g5raLcSarObLgPD76%2FpQHQ%3D%3D
H1-H3 = holes:MOUNT-HOLE: MOUNTING HOLE with drill center marker
IC1 = XC9263B755MR-G:XC9263B755MR-G: Switching Voltage Regulators 18V DCDC Converters 0.5A Sync PWM Source: Datasheet <https://www.torexsemi.com/file/xc9263/XC9263-XC9264.pdf>; DESCRIPTION: Switching Voltage Regulators 18V DCDC Converters 0.5A Sync PWM; HEIGHT: 1.3mm; MANUFACTURER_NAME: Torex; MANUFACTURER_PART_NUMBER: XC9263B755MR-G; MOUSER_PART_NUMBER: 865-XC9263B755MR-G; MOUSER_PRICE-STOCK: https://www.mouser.co.uk/ProductDetail/Torex-Semiconductor/XC9263B755MR-G?qs=cRhdKgsiOJrK2%2FwLMTsY9w%3D%3D
IC2 IC5 IC8 IC10 = XC6210B332MR-G:XC6210B332MR-G: LDO Voltage Regulators 700mA High Speed Votage Regulator Source: Datasheet <https://www.torexsemi.com/file/xc6210/XC6210.pdf>; DESCRIPTION: LDO Voltage Regulators 700mA High Speed Votage Regulator; HEIGHT: 1.3mm; MANUFACTURER_NAME: Torex; MANUFACTURER_PART_NUMBER: XC6210B332MR-G; MOUSER_PART_NUMBER: 865-XC6210B332MR-G; MOUSER_PRICE-STOCK: https://www.mouser.co.uk/ProductDetail/Torex-Semiconductor/XC6210B332MR-G?qs=AsjdqWjXhJ%2FS4LOuBYdYHQ%3D%3D
IC3 = MKLIB:LM4041: PRECISION MICROPOWER SHUNT VOLTAGE REFERENCE Source: http://focus.ti.com/lit/ds/slcs146e/slcs146e.pdf
IC4 = L6981NDR:L6981NDR: Switching Voltage Regulators 38 V, 1.5 A synchronous step-down converter with low quiescent current Source: Datasheet <https://www.mouser.com/datasheet/2/389/dm00747618-2042093.pdf>; DESCRIPTION: Switching Voltage Regulators 38 V, 1.5 A synchronous step-down converter with low quiescent current; HEIGHT: 1.75mm; MANUFACTURER_NAME: STMicroelectronics; MANUFACTURER_PART_NUMBER: L6981NDR; MOUSER_PART_NUMBER: 511-L6981NDR; MOUSER_PRICE-STOCK: https://www.mouser.co.uk/ProductDetail/STMicroelectronics/L6981NDR?qs=stqOd1AaK78HY3hz4we1Pw%3D%3D
IC6 = STM32H723ZGT6:STM32H723ZGT6: ARM Microcontrollers - MCU High-performance and DSP with DP-FPU, Arm Cortex-M7 MCU with 1 MByte Flash Source: Datasheet <https://www.mouser.cn/datasheet/2/389/stm32h723zg-1893346.pdf>; ARROW_PART_NUMBER: STM32H723ZGT6; ARROW_PRICE-STOCK: https://www.arrow.com/en/products/stm32h723zgt6/stmicroelectronics?region=nac; DESCRIPTION: ARM Microcontrollers - MCU High-performance and DSP with DP-FPU, Arm Cortex-M7 MCU with 1 MByte Flash; HEIGHT: 1.6mm; MANUFACTURER_NAME: STMicroelectronics; MANUFACTURER_PART_NUMBER: STM32H723ZGT6; MOUSER_PART_NUMBER: 511-STM32H723ZGT6; MOUSER_PRICE-STOCK: https://www.mouser.co.uk/ProductDetail/STMicroelectronics/STM32H723ZGT6?qs=sPbYRqrBIVkPaOxQT7wG%252BA%3D%3D
IC7 = MKLIB:APS6404L-3SQR-SN
IC9 = MKLIB:OV2640
IC11 IC13 = TXB0104DR:TXB0104DR: 4-Bit Bidirectional Voltage-Level Shifter with Auto Direction Sensing and +/-15 kV ESD Protect Source: Datasheet <http://www.ti.com/lit/gpn/txb0104>; ARROW_PART_NUMBER: TXB0104DR; ARROW_PRICE-STOCK: https://www.arrow.com/en/products/txb0104dr/texas-instruments?region=nac; DESCRIPTION: 4-Bit Bidirectional Voltage-Level Shifter with Auto Direction Sensing and +/-15 kV ESD Protect; HEIGHT: 1.75mm; MANUFACTURER_NAME: Texas Instruments; MANUFACTURER_PART_NUMBER: TXB0104DR; MOUSER_PART_NUMBER: 595-TXB0104DR; MOUSER_PRICE-STOCK: https://www.mouser.co.uk/ProductDetail/Texas-Instruments/TXB0104DR?qs=oFXvjAmG9EgBSYD5QAjkqQ%3D%3D
IC12 = A7670C-LNSC:A7670C-LNSC: MODULE LTE CAT1 Source: Datasheet <https://nostris.ee/pdf/A7670 Series Hardware Design_V1.00.pdf>; DESCRIPTION: MODULE LTE CAT1; HEIGHT: 2.77mm; MANUFACTURER_NAME: SIMCOM; MANUFACTURER_PART_NUMBER: A7670C-LNSC
IC14 IC17 = reg60:USBLC6-2; SMD: SMD Mark: UL26
IC15 = ESP32-S3-WROOM-1U-N16R2:ESP32-S3-WROOM-1U-N16R2: WiFi Modules - 802.11 [Engineering Samples] SMD Module, ESP32-S3R2, 2 MB PSRAM Die, 16 MB SPI Flash, IPEX Antenna Connector. Source: Datasheet <https://www.espressif.com/sites/default/files/documentation/esp32-s3-wroom-1_wroom-1u_datasheet_en.pdf>; DESCRIPTION: WiFi Modules - 802.11 [Engineering Samples] SMD Module, ESP32-S3R2, 2 MB PSRAM Die, 16 MB SPI Flash, IPEX Antenna Connector.; HEIGHT: 3.35mm; MANUFACTURER_NAME: Espressif Systems; MANUFACTURER_PART_NUMBER: ESP32-S3-WROOM-1U-N16R2; MOUSER_PART_NUMBER: 356-ESP32S3WM1UN16R2; MOUSER_PRICE-STOCK: https://www.mouser.co.uk/ProductDetail/Espressif-Systems/ESP32-S3-WROOM-1U-N16R2?qs=Li%252BoUPsLEntVNO2wkikhdA%3D%3D
IC16 = reg60:LAN8720
IMG1 = MKLIB:IMAGE
J1 = con-jack:DCJ0202: DC POWER JACK Source: DCJ0202.pdf; OC_FARNELL: unknown; OC_NEWARK: unknown
J2 = 693043020611:693043020611: Memory Card Connectors WR-CRD Nano SIM SMT 1.2mm Push/Pull Source: Datasheet <http://katalog.we-online.de/em/datasheet/693043020611.pdf>; DESCRIPTION: Memory Card Connectors WR-CRD Nano SIM SMT 1.2mm Push/Pull; HEIGHT: mm; MANUFACTURER_NAME: Wurth Elektronik; MANUFACTURER_PART_NUMBER: 693043020611; MOUSER_PART_NUMBER: 710-693043020611; MOUSER_PRICE-STOCK: https://www.mouser.co.uk/ProductDetail/Wurth-Elektronik/693043020611?qs=a9WhcLg8qCwC%2FpVEDAdA2Q%3D%3D
J3 = U.FL-R-SMT_01_:U.FL-R-SMT_01_: Hirose 50 Straight Surface Mount, jack Ultra Small Surface Mount Coaxial Connectors - 1.9mm or 2.3mm, 2.4mm Mated Height Source: Datasheet <https://componentsearchengine.com/Datasheets/2/U.FL-R-SMT(01).pdf>; DESCRIPTION: Hirose 50 Straight Surface Mount, jack Ultra Small Surface Mount Coaxial Connectors - 1.9mm or 2.3mm, 2.4mm Mated Height; HEIGHT: 1.25mm; MANUFACTURER_NAME: Hirose; MANUFACTURER_PART_NUMBER: U.FL-R-SMT(01); MOUSER_PART_NUMBER: 798-U.FL-R-SMT01; MOUSER_PRICE-STOCK: https://www.mouser.co.uk/ProductDetail/Hirose-Connector/U.FL-R-SMT01?qs=Ux3WWAnHpjDV3tCCbDi65g%3D%3D
J4 = J3011G21DNL:J3011G21DNL: Modular Connectors / Ethernet Connectors SMT 1X1 TAB UP 4CORE Source: Datasheet <http://productfinder.pulseeng.com/products/datasheets/J409.pdf>; ARROW_PART_NUMBER: J3011G21DNL; ARROW_PRICE-STOCK: https://www.arrow.com/en/products/j3011g21dnl/pulse-electronics-corporation?region=nac; DESCRIPTION: Modular Connectors / Ethernet Connectors SMT 1X1 TAB UP 4CORE; HEIGHT: mm; MANUFACTURER_NAME: Pulse; MANUFACTURER_PART_NUMBER: J3011G21DNL; MOUSER_PART_NUMBER: 673-J3011G21DNL; MOUSER_PRICE-STOCK: https://www.mouser.co.uk/ProductDetail/Pulse-Electronics/J3011G21DNL?qs=UCntq0WcAz74w9dC5UtGOw%3D%3D
J5 J7 = 44144-0004:44144-0004: Modular Connectors / Ethernet Connectors 6/4 FLUSH SMT Source: Datasheet <https://www.molex.com/pdm_docs/sd/441440004_sd.pdf>; DESCRIPTION: Modular Connectors / Ethernet Connectors 6/4 FLUSH SMT; HEIGHT: 11.91mm; MANUFACTURER_NAME: Molex; MANUFACTURER_PART_NUMBER: 44144-0004; MOUSER_PART_NUMBER: 538-44144-0004; MOUSER_PRICE-STOCK: https://www.mouser.co.uk/ProductDetail/Molex/44144-0004?qs=UeCeOHRHQeYLMH4RUNPyzA%3D%3D
J6 = con-JST-XH:JST-XH-4: JST-XH 4-way vertical TH; MF: JST; MPN: B4B-XH-A
J8 J11 = con-JST-XH:JST-XH-8: JST-XH 4-way vertical TH; MF: JST; MPN: B8B-XH-A
J9 = M20-8750342:M20-8750342: Headers & Wire Housings 2.54mm 3+3 DIL SMT P/HDR W/PEGS Source: Datasheet <https://cdn.harwin.com/pdfs/M20-875.pdf>; DESCRIPTION: Headers & Wire Housings 2.54mm 3+3 DIL SMT P/HDR W/PEGS; HEIGHT: 7.54mm; MANUFACTURER_NAME: Harwin; MANUFACTURER_PART_NUMBER: M20-8750342; MOUSER_PART_NUMBER: 855-M20-8750342; MOUSER_PRICE-STOCK: https://www.mouser.co.uk/ProductDetail/Harwin/M20-8750342?qs=k41KVqW3ymq%2FIU%2Fsn4l0Vg%3D%3D
J10 = M20-8750742:M20-8750742: Headers & Wire Housings 2.54mm 7+7 DIL SMT P/HDR W/PEGS Source: Datasheet <https://cdn.harwin.com/pdfs/M20-875.pdf>; DESCRIPTION: Headers & Wire Housings 2.54mm 7+7 DIL SMT P/HDR W/PEGS; HEIGHT: 8.54mm; MANUFACTURER_NAME: Harwin; MANUFACTURER_PART_NUMBER: M20-8750742; MOUSER_PART_NUMBER: 855-M20-8750742; MOUSER_PRICE-STOCK: https://www.mouser.co.uk/ProductDetail/Harwin/M20-8750742?qs=k41KVqW3ymqdmigli%252BOd3Q%3D%3D
J12 = 62910416121:62910416121: Wurth Elektronik 1 Port Right Angle Surface Mount Female Version 2.0 Type B USB Connector Source: Datasheet <https://katalog.we-online.de/em/datasheet/62910416121.pdf>; DESCRIPTION: Wurth Elektronik 1 Port Right Angle Surface Mount Female Version 2.0 Type B USB Connector; HEIGHT: 11.35mm; MANUFACTURER_NAME: Wurth Elektronik; MANUFACTURER_PART_NUMBER: 62910416121; MOUSER_PART_NUMBER: 710-62910416121; MOUSER_PRICE-STOCK: https://www.mouser.co.uk/ProductDetail/Wurth-Elektronik/62910416121?qs=7gQLVZk5cPl%252BMjVYEg%252B8ng%3D%3D
JP1 JP2 = MKLIB:JP2Q: JUMPER
L1 L4 = reg60:INDUCTOR
L2 = MKLIB:L-EU
L3 L5 L6 L8 = inductors:BLM15H: EMIFIL (R) Chip Ferrite Bead for GHz Noise Source: http://www.murata.com/ Ferrite Bead BLM15H.pdf
L7 = rcl:L-US: INDUCTOR, American symbol
LED1 LED2 = led:LED: LED OSRAM: - CHIPLED LG R971, LG N971, LY N971, LG Q971, LY Q971, LO R971, LY R971 LH N974, LH R974 LS Q976, LO Q976, LY Q976 LO Q996 - Hyper CHIPLED LW Q18S LB Q993, LB Q99A, LB R99A - SideLED LS A670, LO A670, LY A670, LG A670, LP A670 LB A673, LV A673, LT A673, LW A673 LH A674 LY A675 LS A676, LA A676, LO A676, LY A676, LW A676 LS A679, LY A679, LG A679 - Hyper Micro SIDELED® LS Y876, LA Y876, LO Y876, LY Y876 LT Y87S - SmartLED LW L88C, LW L88S LB L89C, LB L89S, LG L890 LS L89K, LO L89K, LY L89K LS L896, LA L896, LO L896, LY L896 - TOPLED LS T670, LO T670, LY T670, LG T670, LP T670 LSG T670, LSP T670, LSY T670, LOP T670, LYG T670 LG T671, LOG T671, LSG T671 LB T673, LV T673, LT T673, LW T673 LH T674 LS T676, LA T676, LO T676, LY T676, LB T676, LH T676, LSB T676, LW T676 LB T67C, LV T67C, LT T67C, LS T67K, LO T67K, LY T67K, LW E67C LS E67B, LA E67B, LO E67B, LY E67B, LB E67C, LV E67C, LT E67C LW T67C LS T679, LY T679, LG T679 LS T770, LO T770, LY T770, LG T770, LP T770 LB T773, LV T773, LT T773, LW T773 LH T774 LS E675, LA E675, LY E675, LS T675 LS T776, LA T776, LO T776, LY T776, LB T776 LHGB T686 LT T68C, LB T68C - Hyper Mini TOPLED® LB M676 - Mini TOPLED Santana® LG M470 LS M47K, LO M47K, LY M47K Source: http://www.osram.convergy.de LUXEON: - LUMILED® LXK2-PW12-R00, LXK2-PW12-S00, LXK2-PW14-U00, LXK2-PW14-V00 LXK2-PM12-R00, LXK2-PM12-S00, LXK2-PM14-U00 LXK2-PE12-Q00, LXK2-PE12-R00, LXK2-PE12-S00, LXK2-PE14-T00, LXK2-PE14-U00 LXK2-PB12-K00, LXK2-PB12-L00, LXK2-PB12-M00, LXK2-PB14-N00, LXK2-PB14-P00, LXK2-PB14-Q00 LXK2-PR12-L00, LXK2-PR12-M00, LXK2-PR14-Q00, LXK2-PR14-R00 LXK2-PD12-Q00, LXK2-PD12-R00, LXK2-PD12-S00 LXK2-PH12-R00, LXK2-PH12-S00 LXK2-PL12-P00, LXK2-PL12-Q00, LXK2-PL12-R00 Source: www.luxeon.com KINGBRIGHT: KA-3528ASYC Source: www.kingbright.com
Q1 Q3 Q8 Q10 Q12 Q14 = transistor-small-signal:BSS84: P-CHANNEL MOS FET
Q2 Q4 Q9 Q11 Q13 Q15 = transistor-small-signal:BSS123: N-CHANNEL MOS FET
Q5 Q6 = transistor-npn:BC817*: NPN Transistor
Q7 = MKLIB:CRYSTAL2.5X2: CRYSTAL OSCILLATOR 2.5mm x 2 mm
Q16 = reg60:CRYSTAL3.2X2.5: CRYSTAL 3.2x2.5mm FA-238, TSX-3225
Q17 = NX3215SA-32.768K-EXS00A-MU0000:NX3215SA-32.768K-EXS00A-MU0000: Crystals CRYSTAL 32.768KHZ 12.5PF SMD Source: Datasheet <https://media.digikey.com/pdf/Data Sheets/NDK PDFs/NX3215SA-32.768kHz-EXS00A-MU00003.pdf>; DESCRIPTION: Crystals CRYSTAL 32.768KHZ 12.5PF SMD; HEIGHT: 0.9mm; MANUFACTURER_NAME: NDK; MANUFACTURER_PART_NUMBER: NX3215SA-32.768K-EXS00A-MU00003; MOUSER_PART_NUMBER: 344-NX3215SA32.768K3; MOUSER_PRICE-STOCK: https://www.mouser.co.uk/ProductDetail/NDK/NX3215SA-32.768K-EXS00A-MU00003?qs=w%2Fv1CP2dgqrE9YNksyAN9A%3D%3D
R1-R117 = rcl:R-EU_: RESISTOR, European symbol; SPICEPREFIX: R
RV1 = CG0402MLU-3.3G:CG0402MLU-3.3G: ESD Suppressors / TVS Diodes CHIP GUARD 3.3VOLT Source: Datasheet <https://www.bourns.com/docs/Product-Datasheets/MLU.pdf>; ARROW_PART_NUMBER: CG0402MLU-3.3G; ARROW_PRICE-STOCK: https://www.arrow.com/en/products/cg0402mlu-3.3g/bourns; DESCRIPTION: ESD Suppressors / TVS Diodes CHIP GUARD 3.3VOLT; HEIGHT: 0.41mm; MANUFACTURER_NAME: Bourns; MANUFACTURER_PART_NUMBER: CG0402MLU-3.3G; MOUSER_PART_NUMBER: 652-CG0402MLU-3.3G; MOUSER_PRICE-STOCK: https://www.mouser.co.uk/ProductDetail/Bourns/CG0402MLU-3.3G?qs=m8myXnDJXpWVM8EQWErxtQ%3D%3D
S1-S3 = switch-omron:10-XX: OMRON SWITCH; MPN: B3F-1000; OC_FARNELL: 176432; OC_NEWARK: 36M3542
SJ1 = jumper:SJ: SMD solder JUMPER
TP1-TP4 = testpad:TP: Test pad
X1 = con-ptr500:AK500/2: CONNECTOR; OC_FARNELL: unknown; OC_NEWARK: unknown

## Net classes
0 default: width 0.152 mm, clearance 0.152 mm
1 usb: width 0.305 mm, clearance 0.203 mm
2 ETH: width 0.305 mm, clearance 0.203 mm